# EAGLE design teensyMotors02_up (EAGLE 9.1.3)

## Sheet 1 of 2
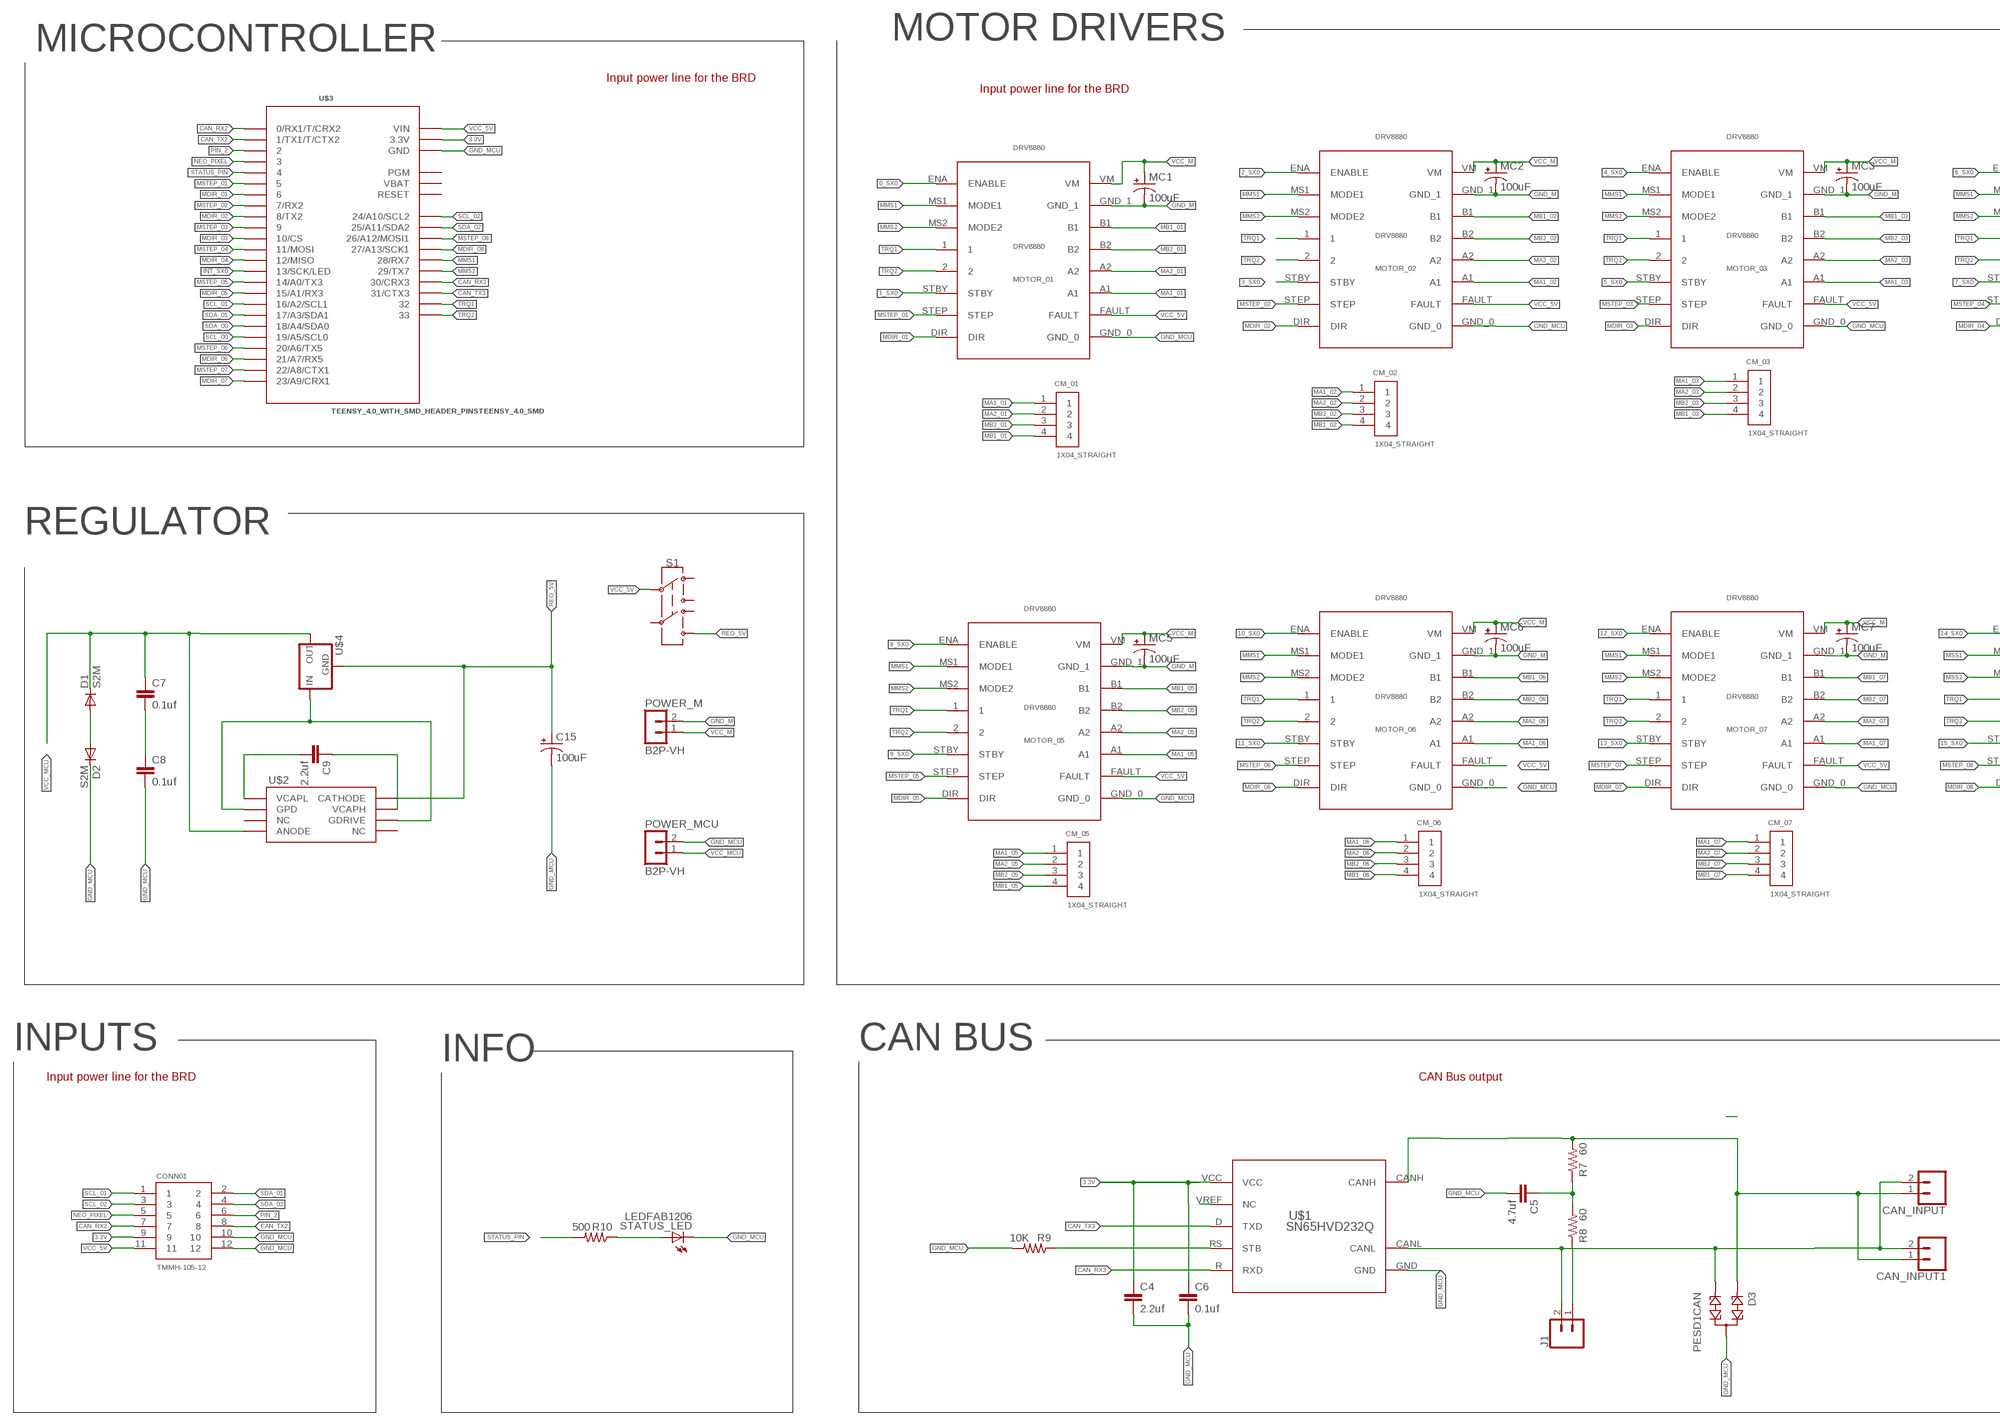
[diagram p0: schematic, sheet 1, part 1 of 2]
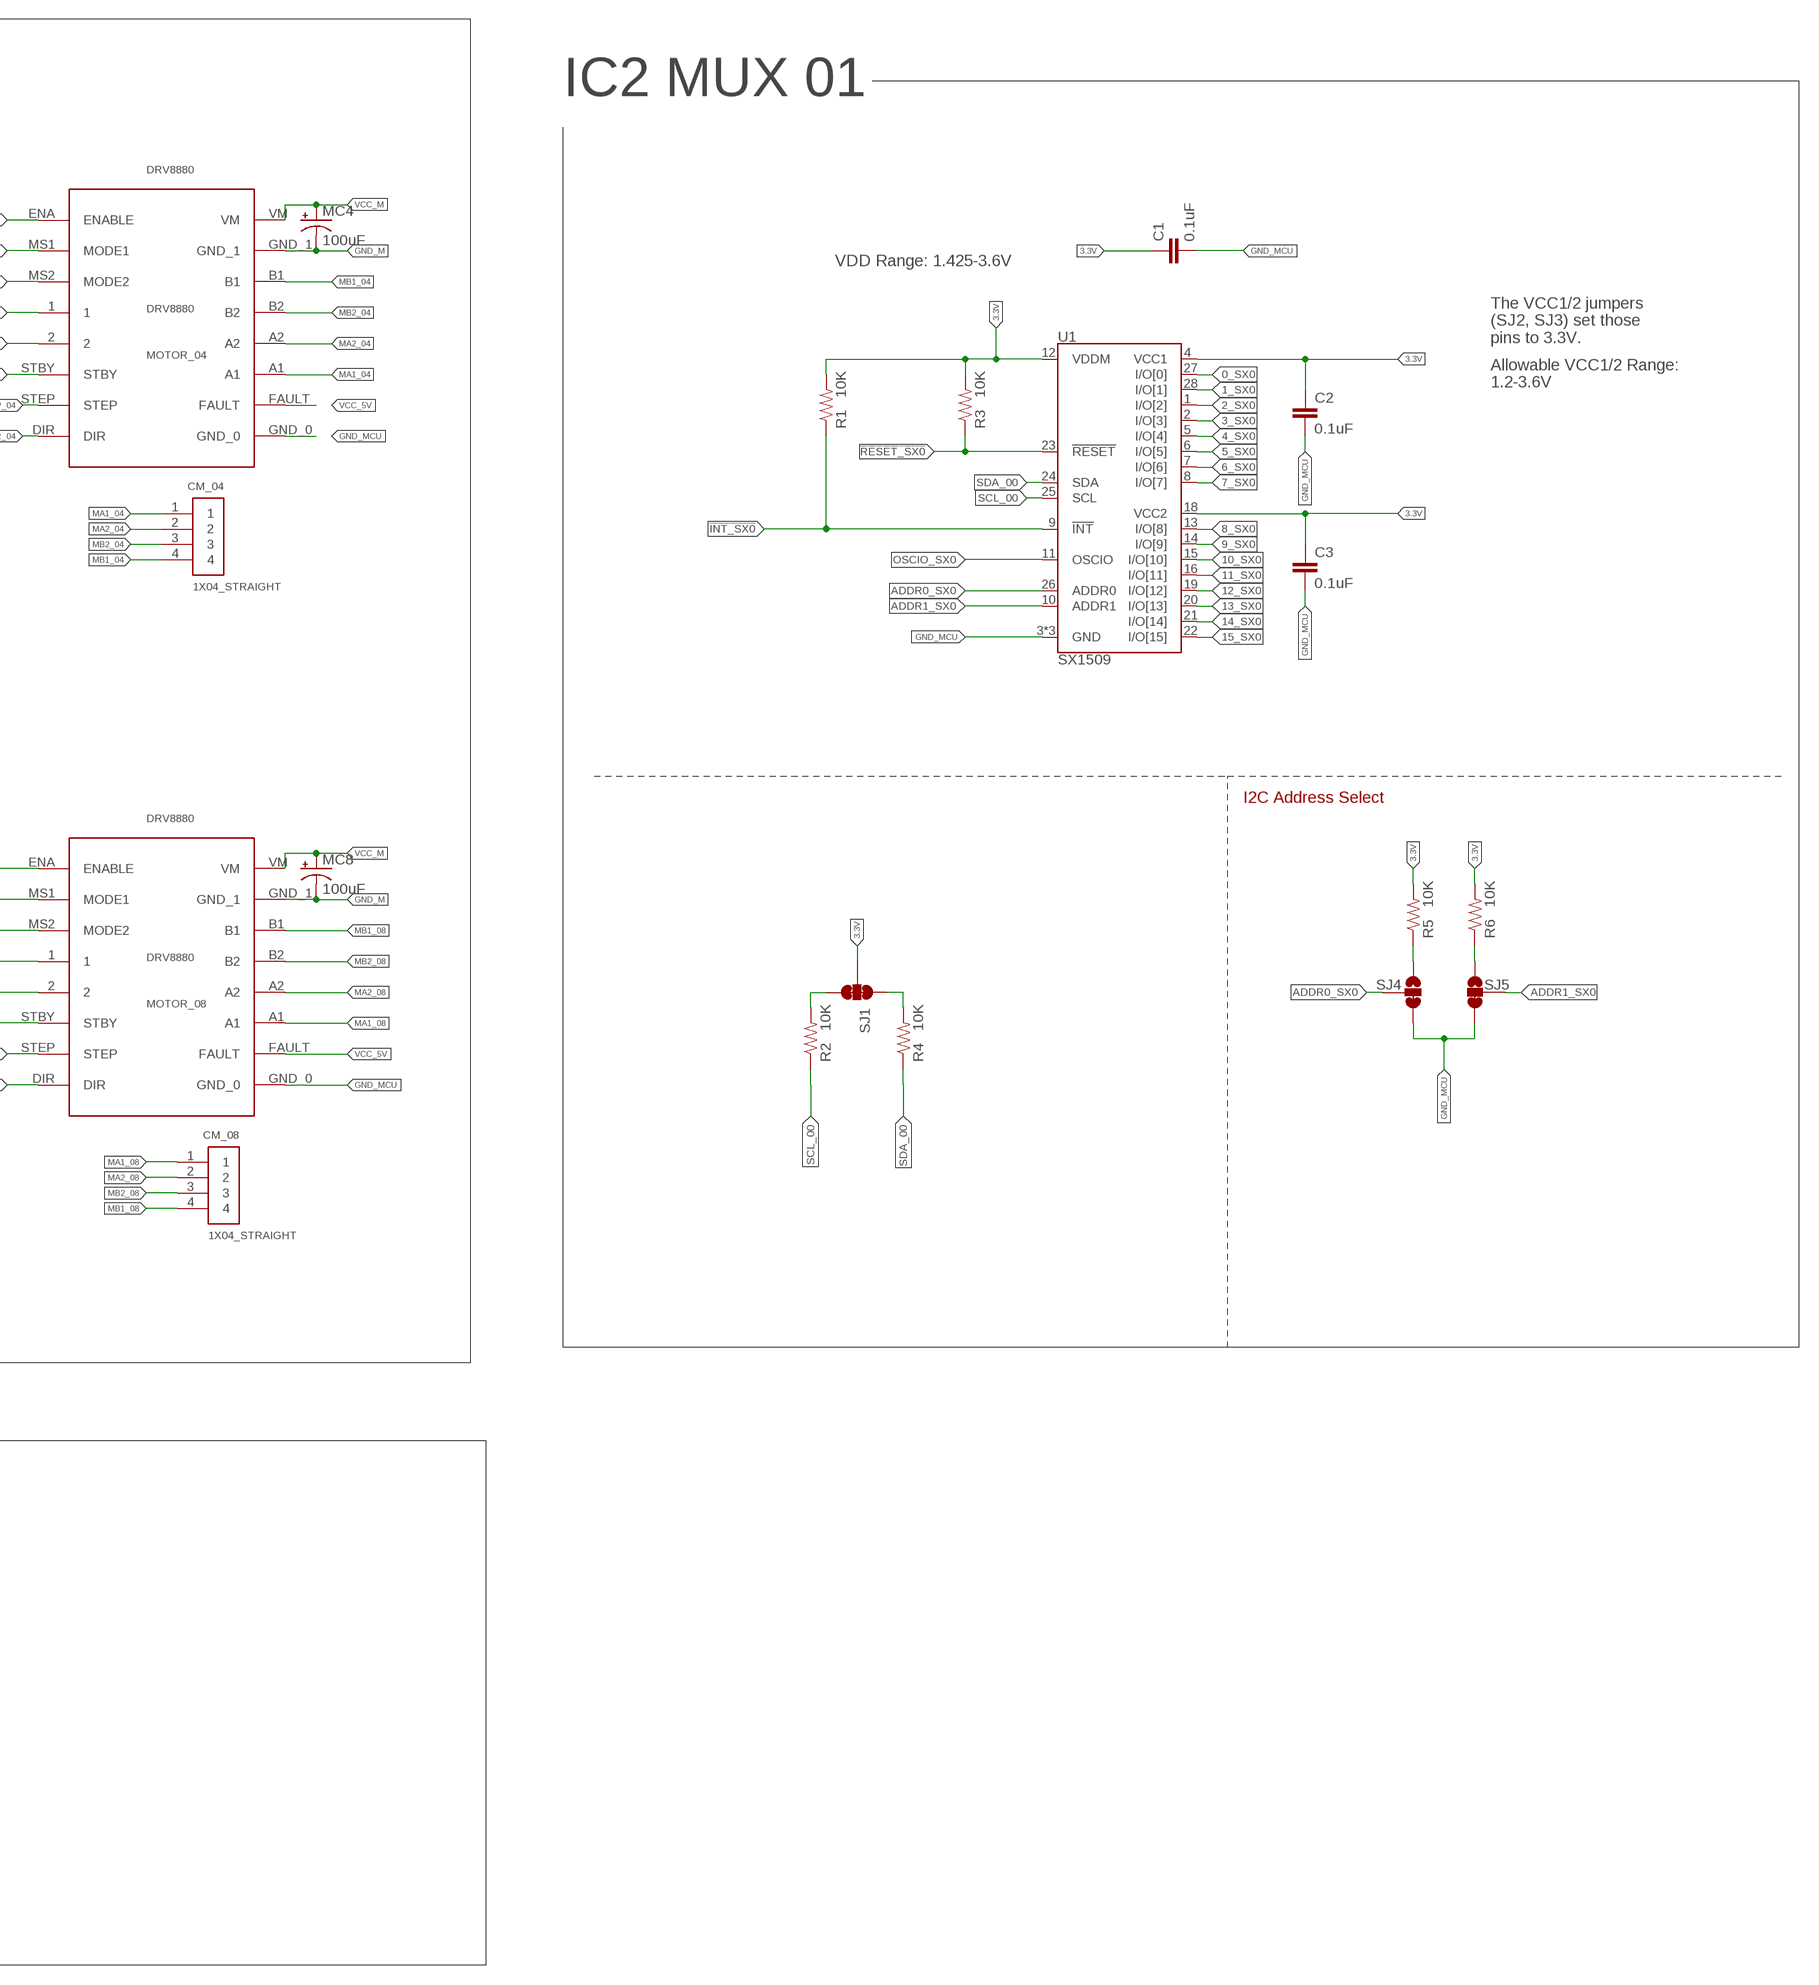
[diagram p1: schematic, sheet 1, part 2 of 2]

### Parts
C1  0.1uF  0.1UF-25V(+80/-20%)(0603)  [0603-CAP]
C2  0.1uF  0.1UF-25V(+80/-20%)(0603)  [0603-CAP]
C3  0.1uF  0.1UF-25V(+80/-20%)(0603)  [0603-CAP]
C4  2.2uf  0.1UF-25V(+80/-20%)(0603)  [0603-CAP]
C5  4.7uf  0.1UF-25V(+80/-20%)(0603)  [0603-CAP]
C6  0.1uf  0.1UF-25V(+80/-20%)(0603)  [0603-CAP]
C7  0.1uf  0.1UF-25V(+80/-20%)(0603)  [0603-CAP]
C8  0.1uf  0.1UF-25V(+80/-20%)(0603)  [0603-CAP]
C9  2.2uf  0.1UF-25V(+80/-20%)(0603)  [0603-CAP]
C15  100uF  100UF-POLAR-25V-20%(ELEC)  [PANASONIC_D]
CAN_INPUT  CONN_02-JST-2MM-SMT  [JST-2-SMD]
CAN_INPUT1  CONN_02-JST-2MM-SMT  [JST-2-SMD]
CM_01  1X04_STRAIGHT  1X4-CLEANBIG  [1X04-CLEANBIG]
CM_02  1X04_STRAIGHT  1X4-CLEANBIG  [1X04-CLEANBIG]
CM_03  1X04_STRAIGHT  1X4-CLEANBIG  [1X04-CLEANBIG]
CM_04  1X04_STRAIGHT  1X4-CLEANBIG  [1X04-CLEANBIG]
CM_05  1X04_STRAIGHT  1X4-CLEANBIG  [1X04-CLEANBIG]
CM_06  1X04_STRAIGHT  1X4-CLEANBIG  [1X04-CLEANBIG]
CM_07  1X04_STRAIGHT  1X4-CLEANBIG  [1X04-CLEANBIG]
CM_08  1X04_STRAIGHT  1X4-CLEANBIG  [1X04-CLEANBIG]
CONN01  TMMH-105-12  [TMMH-105-12]
D1  S2M  [DO214AA]
D2  S2M  [DO214AA]
D3  PESD1CAN  [SOT23]
J1  CONN_02  [1X02]
MC1  100uF  100UF-POLAR-25V-20%(ELEC)  [PANASONIC_D]
MC2  100uF  100UF-POLAR-25V-20%(ELEC)  [PANASONIC_D]
MC3  100uF  100UF-POLAR-25V-20%(ELEC)  [PANASONIC_D]
MC4  100uF  100UF-POLAR-25V-20%(ELEC)  [PANASONIC_D]
MC5  100uF  100UF-POLAR-25V-20%(ELEC)  [PANASONIC_D]
MC6  100uF  100UF-POLAR-25V-20%(ELEC)  [PANASONIC_D]
MC7  100uF  100UF-POLAR-25V-20%(ELEC)  [PANASONIC_D]
MC8  100uF  100UF-POLAR-25V-20%(ELEC)  [PANASONIC_D]
MOTOR_01  DRV8880  [DRV8880]
MOTOR_02  DRV8880  [DRV8880]
MOTOR_03  DRV8880  [DRV8880]
MOTOR_04  DRV8880  [DRV8880]
MOTOR_05  DRV8880  [DRV8880]
MOTOR_06  DRV8880  [DRV8880]
MOTOR_07  DRV8880  [DRV8880]
MOTOR_08  DRV8880  [DRV8880]
POWER_M  B2P-VH  [B2P-VH]
POWER_MCU  B2P-VH  [B2P-VH]
R1  10K  10KOHM-1/10W-1%(0603)0603  [0603-RES]
R2  10K  10KOHM-1/10W-1%(0603)0603  [0603-RES]
R3  10K  10KOHM-1/10W-1%(0603)0603  [0603-RES]
R4  10K  10KOHM-1/10W-1%(0603)0603  [0603-RES]
R5  10K  10KOHM-1/10W-1%(0603)0603  [0603-RES]
R6  10K  10KOHM-1/10W-1%(0603)0603  [0603-RES]
R7  60  10KOHM-1/10W-1%(0603)0603  [0603-RES]
R8  60  10KOHM-1/10W-1%(0603)0603  [0603-RES]
R9  10K  10KOHM-1/10W-1%(0603)0603  [0603-RES]
R10  500  10KOHM-1/10W-1%(0603)0603  [0603-RES]
S1  SWITCH-DPDT-SMD-AYZ0202  [SWITCH_DPDT_SMD_AYZ0202]
SJ1  JUMPER-PAD-3-NC_BY_TRACE  [PAD-JUMPER-3-3OF3_NC_BY_TRACE_YES_SILK_FULL_BOX]
SJ4  JUMPER-PAD-3-2OF3_NC_BY_TRACE_SMALL  [PAD-JUMPER-3-2OF3_NC_BY_TRACE_YES_SILK_FULL_BOX]
SJ5  JUMPER-PAD-3-2OF3_NC_BY_TRACE_SMALL  [PAD-JUMPER-3-2OF3_NC_BY_TRACE_YES_SILK_FULL_BOX]
STATUS_LED  LEDFAB1206  [LED1206FAB]
U1  SX1509  [QFN-28]
U$1  SN65HVD232Q  [SN65HVD232Q]
U$2  LM74610-Q1  [VSSOP(8)]
U$3  TEENSY_4.0_WITH_SMD_HEADER_PINSTEENSY_4.0_SMD  [TEENSY_4.0_SMD]
U$4  BUK  [TO263-3]

### Nets
0_SX0: MOTOR_01.ENA(ENABLE) U1.27(I/O[0])
1_SX0: MOTOR_01.STBY U1.28(I/O[1])
2_SX0: MOTOR_02.ENA(ENABLE) U1.1(I/O[2])
3.3V: C1.1 C2.1 C3.1 C4.1 C6.1 CONN01.9 R1.2 R3.2 R5.2 R6.2 SJ1.2 U1.4(VCC1) U1.12(VDDM) U1.18(VCC2) U$1.VCC U$3.3.3V U$3.3.3V1(3.3V)
3_SX0: MOTOR_02.STBY U1.2(I/O[3])
4_SX0: MOTOR_03.ENA(ENABLE) U1.5(I/O[4])
5_SX0: MOTOR_03.STBY U1.6(I/O[5])
6_SX0: MOTOR_04.ENA(ENABLE) U1.7(I/O[6])
7_SX0: MOTOR_04.STBY U1.8(I/O[7])
8_SX0: MOTOR_05.ENA(ENABLE) U1.13(I/O[8])
9_SX0: MOTOR_05.STBY U1.14(I/O[9])
10_SX0: MOTOR_06.ENA(ENABLE) U1.15(I/O[10])
11_SX0: MOTOR_06.STBY U1.16(I/O[11])
12_SX0: MOTOR_07.ENA(ENABLE) U1.19(I/O[12])
13_SX0: MOTOR_07.STBY U1.20(I/O[13])
14_SX0: MOTOR_08.ENA(ENABLE) U1.21(I/O[14])
15_SX0: MOTOR_08.STBY U1.22(I/O[15])
!INT_SX0: R1.1 U1.9(!INT) U$3.13(13/SCK/LED)
!RESET_SX0: R3.1 U1.23(!RESET)
ADDR0_SX0: SJ4.2 U1.26(ADDR0)
ADDR1_SX0: SJ5.2 U1.10(ADDR1)
CAN_H: CAN_INPUT1.1 CAN_INPUT.1 D3.1 R7.2 U$1.CANH
CAN_L: CAN_INPUT1.2 CAN_INPUT.2 D3.2 J1.2 U$1.CANL
CAN_RX2: CONN01.7 U$3.0(0/RX1/T/CRX2)
CAN_RX3: U$1.R(RXD) U$3.30(30/CRX3)
CAN_TX2: CONN01.8 U$3.1(1/TX1/T/CTX2)
CAN_TX3: U$1.D(TXD) U$3.31(31/CTX3)
GND_M: MC1.- MC2.- MC3.- MC4.- MC5.- MC6.- MC7.- MC8.- MOTOR_01.GND_1 MOTOR_02.GND_1 MOTOR_03.GND_1 MOTOR_04.GND_1 MOTOR_05.GND_1 MOTOR_06.GND_1 MOTOR_07.GND_1 MOTOR_08.GND_1 POWER_M.2
GND_MCU: C1.2 C2.2 C3.2 C4.2 C5.2 C6.2 C8.2 C15.- CONN01.10 CONN01.12 D2.C D3.3 MOTOR_01.GND_0 MOTOR_02.GND_0 MOTOR_03.GND_0 MOTOR_04.GND_0 MOTOR_05.GND_0 MOTOR_06.GND_0 MOTOR_07.GND_0 MOTOR_08.GND_0 POWER_MCU.2 R9.2 SJ4.3 SJ5.3 STATUS_LED.2(C) U1.3(GND) U1.17(GND) U1.29(GND) U$1.GND U$3.GND U$3.GND1(GND) U$3.GND2(GND)
MA1_01 [drv]: CM_01.1 MOTOR_01.A1
MA1_02 [drv]: CM_02.1 MOTOR_02.A1
MA1_03 [drv]: CM_03.1 MOTOR_03.A1
MA1_04 [drv]: CM_04.1 MOTOR_04.A1
MA1_05 [drv]: CM_05.1 MOTOR_05.A1
MA1_06 [drv]: CM_06.1 MOTOR_06.A1
MA1_07 [drv]: CM_07.1 MOTOR_07.A1
MA1_08 [drv]: CM_08.1 MOTOR_08.A1
MA2_01 [drv]: CM_01.2 MOTOR_01.A2
MA2_02 [drv]: CM_02.2 MOTOR_02.A2
MA2_03 [drv]: CM_03.2 MOTOR_03.A2
MA2_04 [drv]: CM_04.2 MOTOR_04.A2
MA2_05 [drv]: CM_05.2 MOTOR_05.A2
MA2_06 [drv]: CM_06.2 MOTOR_06.A2
MA2_07 [drv]: CM_07.2 MOTOR_07.A2
MA2_08 [drv]: CM_08.2 MOTOR_08.A2
MB1_01 [drv]: CM_01.4 MOTOR_01.B1
MB1_02 [drv]: CM_02.4 MOTOR_02.B1
MB1_03 [drv]: CM_03.4 MOTOR_03.B1
MB1_04 [drv]: CM_04.4 MOTOR_04.B1
MB1_05 [drv]: CM_05.4 MOTOR_05.B1
MB1_06 [drv]: CM_06.4 MOTOR_06.B1
MB1_07 [drv]: CM_07.4 MOTOR_07.B1
MB1_08 [drv]: CM_08.4 MOTOR_08.B1
MB2_01 [drv]: CM_01.3 MOTOR_01.B2
MB2_02 [drv]: CM_02.3 MOTOR_02.B2
MB2_03 [drv]: CM_03.3 MOTOR_03.B2
MB2_04 [drv]: CM_04.3 MOTOR_04.B2
MB2_05 [drv]: CM_05.3 MOTOR_05.B2
MB2_06 [drv]: CM_06.3 MOTOR_06.B2
MB2_07 [drv]: CM_07.3 MOTOR_07.B2
MB2_08 [drv]: CM_08.3 MOTOR_08.B2
MDIR_01: MOTOR_01.DIR U$3.6
MDIR_02: MOTOR_02.DIR U$3.8(8/TX2)
MDIR_03: MOTOR_03.DIR U$3.10(10/CS)
MDIR_04: MOTOR_04.DIR U$3.12(12/MISO)
MDIR_05: MOTOR_05.DIR U$3.15/A1(15/A1/RX3)
MDIR_06: MOTOR_06.DIR U$3.21/A7(21/A7/RX5)
MDIR_07: MOTOR_07.DIR U$3.23/A9(23/A9/CRX1)
MDIR_08: MOTOR_08.DIR U$3.27(27/A13/SCK1)
MMS1: MOTOR_01.MS1(MODE1) MOTOR_02.MS1(MODE1) MOTOR_03.MS1(MODE1) MOTOR_04.MS1(MODE1) MOTOR_05.MS1(MODE1) MOTOR_06.MS1(MODE1) MOTOR_07.MS1(MODE1) U$3.28(28/RX7)
MMS2: MOTOR_01.MS2(MODE2) MOTOR_02.MS2(MODE2) MOTOR_03.MS2(MODE2) MOTOR_04.MS2(MODE2) MOTOR_05.MS2(MODE2) MOTOR_06.MS2(MODE2) MOTOR_07.MS2(MODE2) U$3.29(29/TX7)
MSS1: MOTOR_08.MS1(MODE1)
MSS2: MOTOR_08.MS2(MODE2)
MSTEP_01: MOTOR_01.STEP U$3.5
MSTEP_02: MOTOR_02.STEP U$3.7(7/RX2)
MSTEP_03: MOTOR_03.STEP U$3.9
MSTEP_04: MOTOR_04.STEP U$3.11(11/MOSI)
MSTEP_05: MOTOR_05.STEP U$3.14/A0(14/A0/TX3)
MSTEP_06: MOTOR_06.STEP U$3.20/A6(20/A6/TX5)
MSTEP_07: MOTOR_07.STEP U$3.22/A8(22/A8/CTX1)
MSTEP_08: MOTOR_08.STEP U$3.26(26/A12/MOSI1)
N$1: R2.2 SJ1.3
N$2: C9.1 U$2.VCAPH
N$3: U$1.VREF(NC)
N$4: U$2.GDRIVE U$2.GPD U$4.1(IN)
N$5: C9.2 U$2.VCAPL
N$6: R9.1 U$1.RS(STB)
N$7: R4.2 SJ1.1
N$8: R5.1 SJ4.1
N$9: C7.2 C8.1
N$10: R6.1 SJ5.1
N$12: D1.A D2.A
N$13: C5.1 R7.1 R8.2
N$14: J1.1 R8.1
N$193: R10.1 STATUS_LED.1(A)
NEO_PIXEL: CONN01.5 U$3.3
OSCIO_SX0: U1.11(OSCIO)
PIN_2: CONN01.6 U$3.2
REG_5V: C15.+ S1.6 U$2.CATHODE U$4.4(GND)
SCL_00: R2.1 U1.25(SCL) U$3.19/A5(19/A5/SCL0)
SCL_01: CONN01.1 U$3.16/A2(16/A2/SCL1)
SCL_02: CONN01.3 U$3.24(24/A10/SCL2)
SDA_00: R4.1 U1.24(SDA) U$3.18/A4(18/A4/SDA0)
SDA_01: CONN01.2 U$3.17/A3(17/A3/SDA1)
SDA_02: CONN01.4 U$3.25(25/A11/SDA2)
STATUS_PIN: R10.2 U$3.4
TRQ1: MOTOR_01.1 MOTOR_02.1 MOTOR_03.1 MOTOR_04.1 MOTOR_05.1 MOTOR_06.1 MOTOR_07.1 MOTOR_08.1 U$3.32
TRQ2: MOTOR_01.2 MOTOR_02.2 MOTOR_03.2 MOTOR_04.2 MOTOR_05.2 MOTOR_06.2 MOTOR_07.2 MOTOR_08.2 U$3.33
VCC_5V [5v]: CONN01.11 MOTOR_01.FAULT MOTOR_02.FAULT MOTOR_03.FAULT MOTOR_04.FAULT MOTOR_05.FAULT MOTOR_06.FAULT MOTOR_07.FAULT MOTOR_08.FAULT S1.2 U$3.VIN
VCC_M [vcc]: MC1.+ MC2.+ MC3.+ MC4.+ MC5.+ MC6.+ MC7.+ MC8.+ MOTOR_01.VM MOTOR_02.VM MOTOR_03.VM MOTOR_04.VM MOTOR_05.VM MOTOR_06.VM MOTOR_07.VM MOTOR_08.VM POWER_M.1
VCC_MCU [vcc]: C7.1 D1.C POWER_MCU.1 U$2.ANODE U$4.3(OUT)
Unconnected: S1.1 S1.3 S1.4 S1.5 U$2.NC@1(NC) U$2.NC@2(NC) U$3.PGM U$3.RESET

### Notes on the sheet
- MICROCONTROLLER | MOTOR DRIVERS
- Input power line for the BRD
- Input power line for the BRD | IC2 MUX 01
- VDD Range: 1.425-3.6V
- The VCC1/2 jumpers 
  (SJ2, SJ3) set those 
  pins to 3.3V.
- Allowable VCC1/2 Range: 
  1.2-3.6V
- REGULATOR
- I2C Address Select
- INPUTS | INFO | CAN BUS
- Input power line for the BRD | CAN Bus output

## Sheet 2 of 2

## Power pins joined to a net without a drawn wire
VBAT: U$3.VBAT

## Library data of the parts
C1-C3 = SparkFun-Capacitors:0.1UF-25V(+80/-20%)(0603): CAP-00810 Ceramic Standard decoupling cap; PROD_ID: CAP-00810
C4-C9 = SparkFun-Capacitors:0.1UF-25V(+80/-20%)(0603): CAP-00810 Ceramic Standard decoupling cap; PROD_ID: CAP-00810; VALUE: 0.1uF
C15 MC1-MC8 = SparkFun-Capacitors:100UF-POLAR: 100µF polarized capacitors A capacitor is a passive two-terminal electrical component used to store electrical energy temporarily in an electric field.; PROD_ID: CAP-12547
CAN_INPUT CAN_INPUT1 = SparkFun-Connectors:CONN_02: Multi connection point. Often used as Generic Header-pin footprint for 0.1 inch spaced/style header connections On any of the 0.1 inch spaced packages, you can populate with these: Break Away Headers - Straight <https://www.sparkfun.com/products/116> (PRT-00116) Break Away Male Headers - Right Angle <https://www.sparkfun.com/products/553> (PRT-00553) Female Headers <https://www.sparkfun.com/products/115> (PRT-00115) Break Away Headers - Machine Pin <https://www.sparkfun.com/products/117> (PRT-00117) Break Away Female Headers - Swiss Machine Pin <https://www.sparkfun.com/products/743> (PRT-00743) For SCREWTERMINALS and SPRING TERMINALS visit here: Screw Terimnals on SparkFun.com <https://www.sparkfun.com/search/results?term=Screw+Terminals> (5mm/3.5mm/2.54mm spacing) This device is also useful as a general connection point to wire up your design to another part of your project. Our various solder wires solder well into these plated through hole pads. Hook-Up Wire - Assortment (Stranded, 22 AWG) <https://www.sparkfun.com/products/11375> (PRT-11375) Hook-Up Wire - Assortment (Solid Core, 22 AWG) <https://www.sparkfun.com/products/11367> (PRT-11367) View the entire wire category on our website here <https://www.sparkfun.com/categories/141> Special notes: Molex polarized connector foot print use with: PRT-08233 with associated crimp pins and housings. 2.54_SCREWTERM for use with PRT-10571. 3.5mm Screw Terminal footprints for PRT-08084 5mm Screw Terminal footprints for use with PRT-08432; PROD_ID: CONN-11443
CM_01-CM_08 = adafruit:1X4: 4-pin connector
CONN01 = TMMH-105-XX-XX-DV:TMMH-105-12: 2mm (.0787") Flex Shroud, .020" (.51mm) Square Post Terminal Strip, Surface Mount,10 Pins.
D1 D2 = s2x_10:S2*: S2A - S2M General Purpose Rectifiers Source: http://www.fairchildsemi.com/datasheets/S2/S2A.pdf; MF: Fairchild; MPN: S2M; OC_FARNELL: 9843876; OC_NEWARK: 58K9553
D3 = diode:PESD1CAN: CAN bus ESD protection diode Source: http://www.nxp.com/documents/data_sheet/PESD1CAN.pdf
J1 = SparkFun-Connectors:CONN_02: Multi connection point. Often used as Generic Header-pin footprint for 0.1 inch spaced/style header connections On any of the 0.1 inch spaced packages, you can populate with these: Break Away Headers - Straight <https://www.sparkfun.com/products/116> (PRT-00116) Break Away Male Headers - Right Angle <https://www.sparkfun.com/products/553> (PRT-00553) Female Headers <https://www.sparkfun.com/products/115> (PRT-00115) Break Away Headers - Machine Pin <https://www.sparkfun.com/products/117> (PRT-00117) Break Away Female Headers - Swiss Machine Pin <https://www.sparkfun.com/products/743> (PRT-00743) For SCREWTERMINALS and SPRING TERMINALS visit here: Screw Terimnals on SparkFun.com <https://www.sparkfun.com/search/results?term=Screw+Terminals> (5mm/3.5mm/2.54mm spacing) This device is also useful as a general connection point to wire up your design to another part of your project. Our various solder wires solder well into these plated through hole pads. Hook-Up Wire - Assortment (Stranded, 22 AWG) <https://www.sparkfun.com/products/11375> (PRT-11375) Hook-Up Wire - Assortment (Solid Core, 22 AWG) <https://www.sparkfun.com/products/11367> (PRT-11367) View the entire wire category on our website here <https://www.sparkfun.com/categories/141> Special notes: Molex polarized connector foot print use with: PRT-08233 with associated crimp pins and housings. 2.54_SCREWTERM for use with PRT-10571. 3.5mm Screw Terminal footprints for PRT-08084 5mm Screw Terminal footprints for use with PRT-08432
MOTOR_01-MOTOR_08 = STSPIN220:DRV8880
POWER_M POWER_MCU = con-JST VH:B2P-VH: JST VH Series header 3.96mm pitch disconnectable crimp style connectors, vertical (side entry type), 2 pins
R1-R6 R9 = SparkFun-Resistors:10KOHM-1/10W-1%(0603): RES-00824; PROD_ID: RES-00824
R7 R8 R10 = SparkFun-Resistors:10KOHM-1/10W-1%(0603): RES-00824; PROD_ID: RES-00824; VALUE: 10K
S1 = SparkFun-Switches:SWITCH-DPDT: Double-Pole, Double-Throw (DPDT) Switch Double-pole, double-throw switches. Variant Overview PTH-GPI-152-3013 Used on SparkFun Geiger Counter <https://www.sparkfun.com/products/11345> SMD-AY0202 Surface Mount DPDT Switch <https://www.sparkfun.com/products/597> (COM-00597) Used on e.g. LilyPad Arduino USB - ATmega32U4 Board <https://www.sparkfun.com/products/12049>; PROD_ID: SWCH-08179; SF_SKU: COM-00597; SPICEPREFIX: X
SJ1 = SparkFun-Passives:JUMPER-PAD-3-NC_BY_TRACE
SJ4 SJ5 = SparkFun-Passives:JUMPER-PAD-3-2OF3_NC_BY_TRACE
STATUS_LED = fab:LED: LED
U1 = SparkFun-DigitalIC:SX1509: Semtech SX1509 The SX1509 is a complete ultra low voltage 1.2V to 3.6V General Purpose parallel Input/Output (GPIO) expanders ideal for low power handheld battery powered equipment. This version comes in a 16-channel configuration and allows easy serial expansion of I/O through a standard 400kHz I2C interface. GPIO devices can provide additional control and monitoring when the microcontroller or chipset has insufficient I/O ports, or in systems where serial communication and control from a remote location is advantageous.; PROD_ID: IC-11311
U$1 = TCAN1042DRQ1:SN65HVD232Q
U$2 = 1zac:LM74610-Q1: LM74610-Q1 Zero IQ Reverse Polarity Protection Smart Diode Controller; MPN: LM74610-Q1
U$3 = Teensy4:TEENSY_4.0_WITH_SMD_HEADER_PINS: Footprint for Teensy 3.1 or 3.2 board using all pin connections on the outer perimeter
U$4 = v-reg-2:BUK

## Net classes
0 default: width 0.2 mm
1 2oz: width 0.2 mm
2 drv: width 0.55 mm
3 vcc: width 0.4 mm
4 5v: width 0.3 mm

## Board
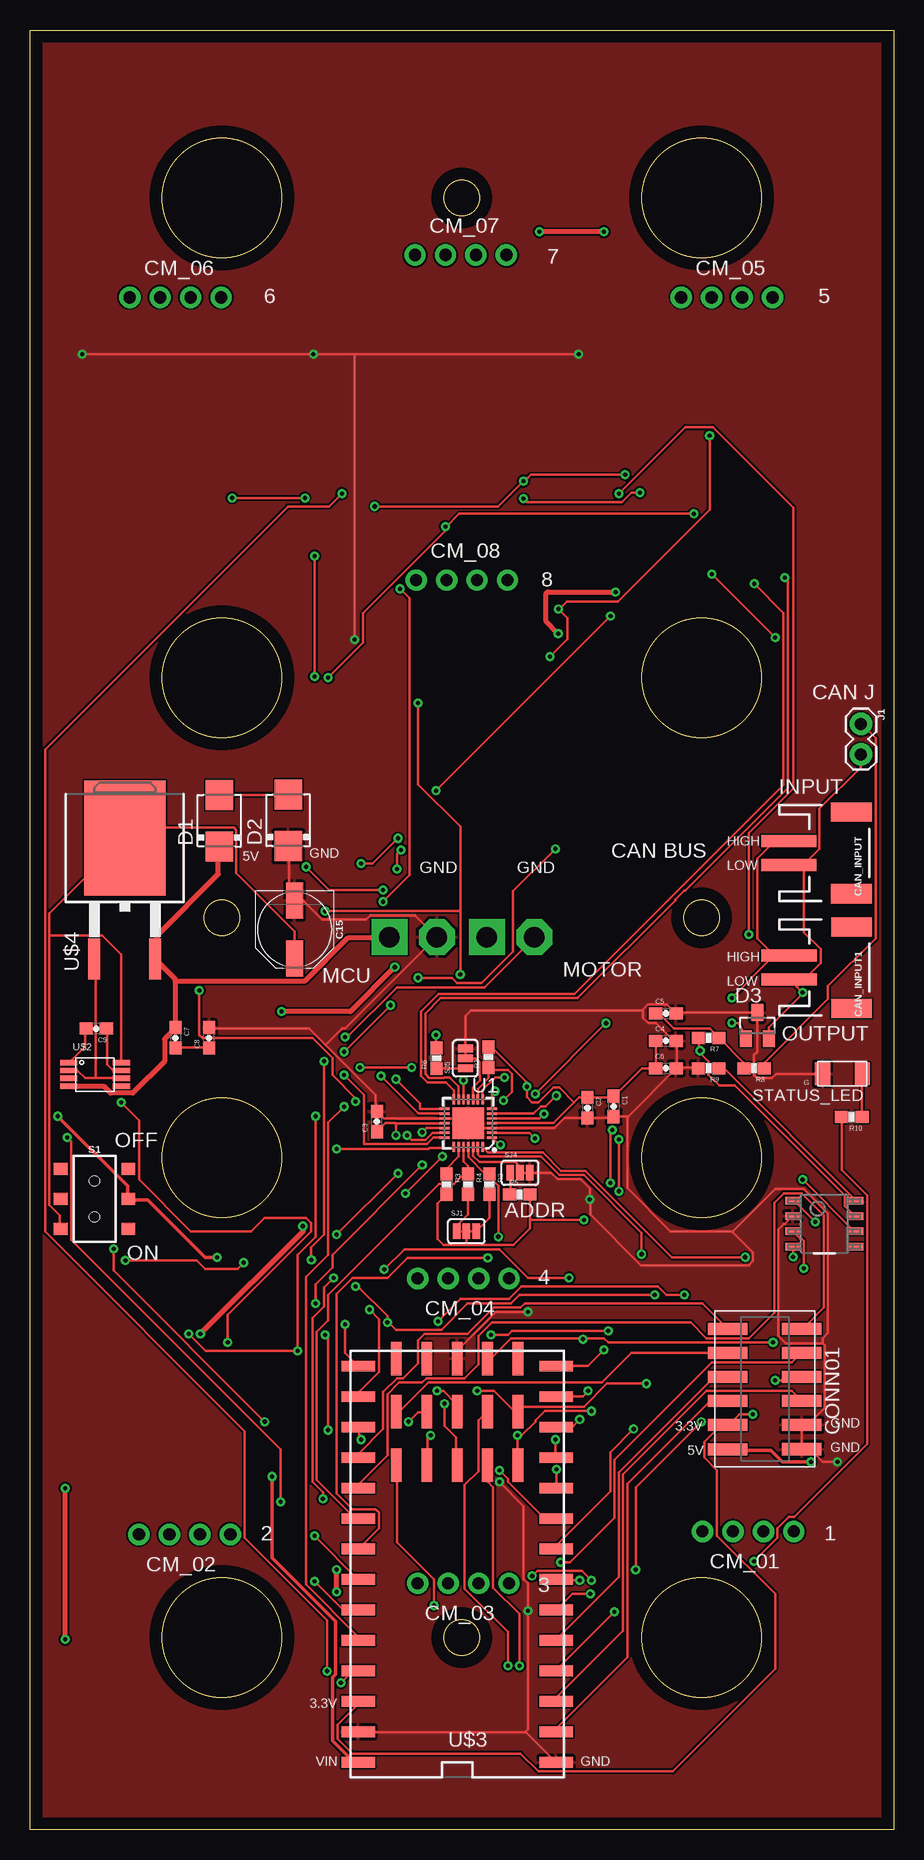
[diagram p2: board, top side]
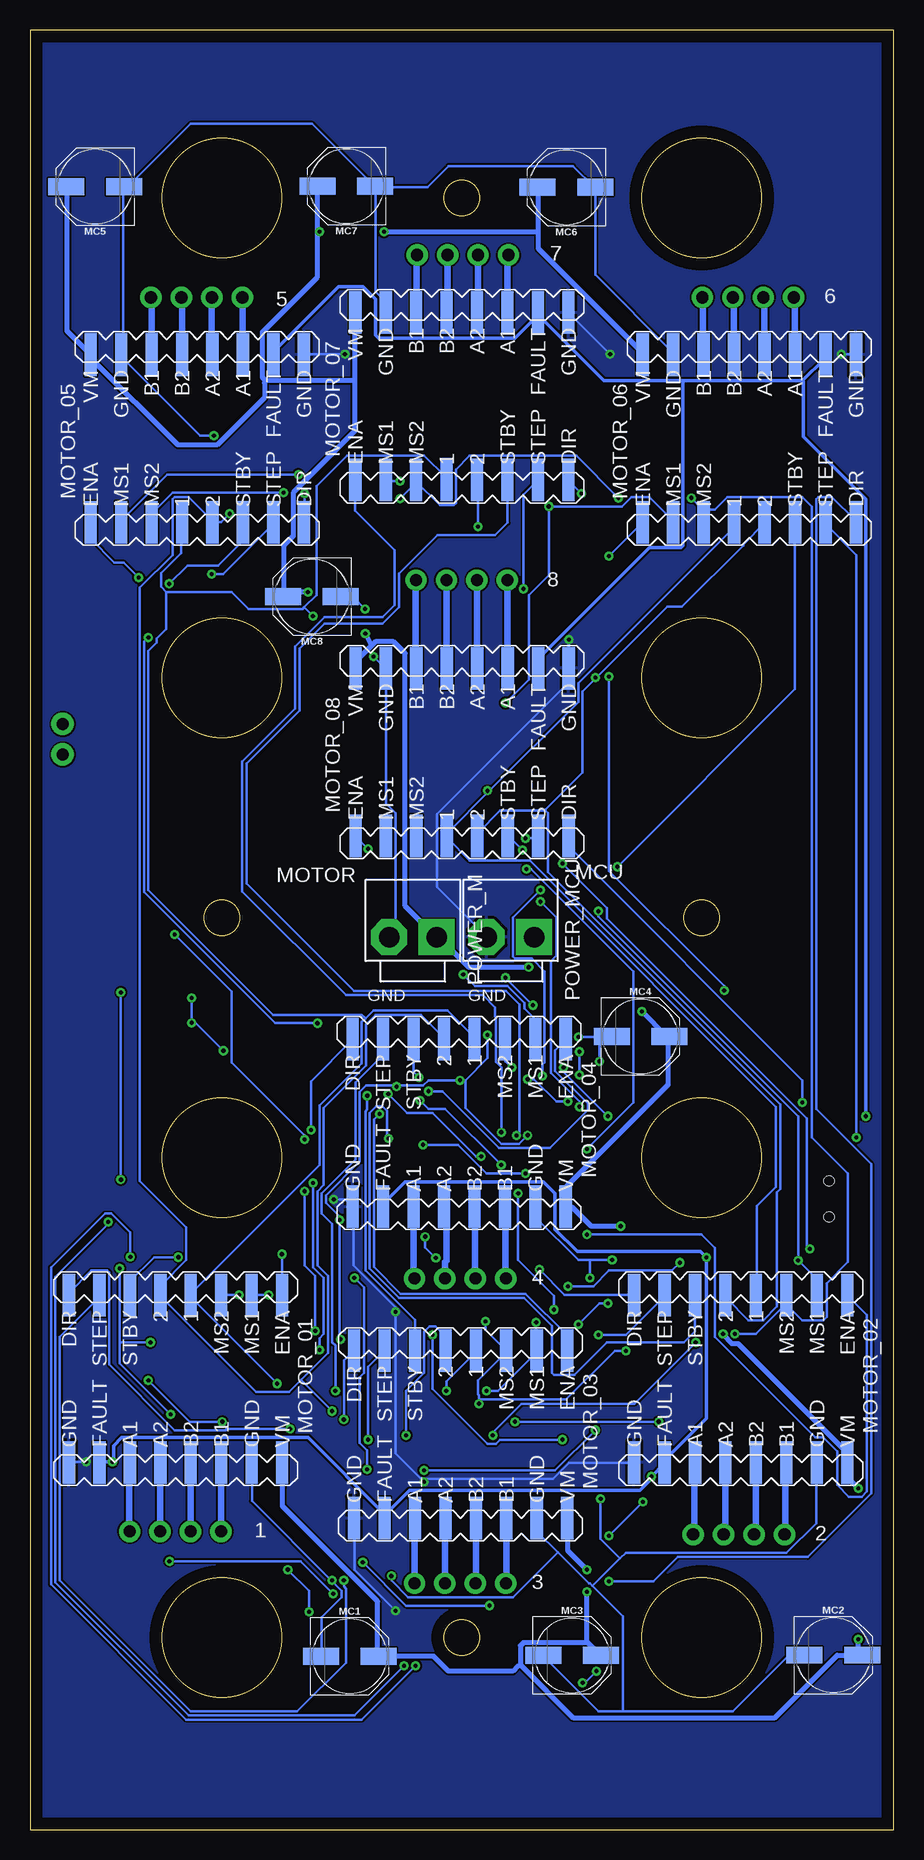
[diagram p3: board, bottom side, seen from below]

Size 72 x 150 mm. Coordinates in mm from the lower left corner, seen from the top.
Outline: 72,150 72,0 0,0 0,150 72,150
Outline: circle at 56,136 radius 5
Outline: circle at 56,96 radius 5
Outline: circle at 56,56 radius 5
Outline: circle at 56,16 radius 5
Outline: circle at 16,16 radius 5
Outline: circle at 16,56 radius 5
Outline: circle at 16,96 radius 5
Outline: circle at 16,136 radius 5
Outline: circle at 36,136 radius 1.5
Outline: circle at 16,76 radius 1.5
Outline: circle at 36,16 radius 1.5
Outline: circle at 56,76 radius 1.5
Copper layers (1*2*15*16): Top 0.035mm / dielectric 10mil / Route2 0.035mm / dielectric 40mil / Route15 0.035mm / dielectric 10mil / Bottom 0.035mm
Design rules "default *": minimum track width 6mil, minimum drill 0.35mm, track to track 6mil, track to pad 6mil, pad to pad 6mil, via to via 6mil, smd to smd 6mil, copper to edge 40mil, drill to drill 6mil, minimum pad ring 10mil, minimum via ring 8mil, stop-mask expansion 4mil, vias tented up to drill 0mil, thermal gap 10mil

### Footprints (pad centres in the part's own frame; a part is rotated, then mirrored left to right if it is on the bottom)
0603-CAP = smd 1.1 x 1: 1 -0.85,0; 2 0.85,0
PANASONIC_D = smd 3 x 1.4: + 2.4,0; - -2.4,0
JST-2-SMD = smd 1 x 4.6: 1 -1,-3.7; 2 1,-3.7 | smd 1.6 x 3.4: NC1 -3.4,1.5; NC2 3.4,1.5
1X04-CLEANBIG = drill 1.016 pad 1.778: 1 -3.81,0; 2 -1.27,0; 3 1.27,0; 4 3.81,0
TMMH-105-12 = smd 1.016 x 3.302: 1 -5.27,-3.086; 2 -5.27,3.086; 3 -3.27,-3.086; 4 -3.27,3.086; 5 -1.27,-3.086; 6 -1.27,3.086; 7 0.73,-3.086; 8 0.73,3.086; 9 2.73,-3.086; 10 2.73,3.086; 11 4.781,-3.099; 12 4.755,3.086
DO214AA = smd 2.5 x 2.3: A 2.15,0; C -2.15,0
SOT23 = smd 1 x 1.4: 1 -0.95,-1.1; 2 0.95,-1.1; 3 0,1.1
1X02 = drill 1.016 pad 1.88: 1 0,0; 2 2.54,0
DRV8880 = smd 3.556 x 1.016: 1 -6.985,1.27; 2 -6.985,-1.27; A1 6.985,-3.81; A2 6.985,-1.27; B1 6.985,3.81; B2 6.985,1.27; DIR -6.985,-8.89; ENA -6.985,8.89; FAULT 6.985,-6.35; GND_0 6.985,-8.89; GND_1 6.985,6.35; MS1 -6.985,6.35; MS2 -6.985,3.81; STBY -6.985,-3.81; STEP -6.985,-6.35; VM 6.985,8.89
B2P-VH = drill 1.7 pad 3 square: 1 -1.98,0 | drill 1.7 pad 3 octagon: 2 1.98,0
0603-RES = smd 1.1 x 1: 1 -0.85,0; 2 0.85,0
SWITCH_DPDT_SMD_AYZ0202 = smd 1 x 1.15: 1 -2.5,2.825; 2 0,2.825; 3 2.5,2.825; 4 -2.5,-2.825; 5 0,-2.825; 6 2.5,-2.825 | hole 0.85: 1.5,0; -1.5,0
PAD-JUMPER-3-3OF3_NC_BY_TRACE_YES_SILK_FULL_BOX = smd 0.635 x 1.27: 1 -0.813,0; 2 0,0; 3 0.813,0
PAD-JUMPER-3-2OF3_NC_BY_TRACE_YES_SILK_FULL_BOX = smd 0.635 x 1.27: 1 -0.813,0; 2 0,0; 3 0.813,0
LED1206FAB = smd 1.27 x 1.905: 1 -1.651,0; 2 1.651,0
QFN-28 = smd 0.85 x 0.2: 1 -1.975,1.2; 2 -1.975,0.8; 3 -1.975,0.4; 4 -1.975,0; 5 -1.975,-0.4; 6 -1.975,-0.8; 7 -1.975,-1.2; 15 1.975,-1.2; 16 1.975,-0.8; 17 1.975,-0.4; 18 1.975,0; 19 1.975,0.4; 20 1.975,0.8; 21 1.975,1.2 | smd 0.2 x 0.85: 8 -1.2,-1.975; 9 -0.8,-1.975; 10 -0.4,-1.975; 11 0,-1.975; 12 0.4,-1.975; 13 0.8,-1.975; 14 1.2,-1.975; 22 1.2,1.975; 23 0.8,1.975; 24 0.4,1.975; 25 0,1.975; 26 -0.4,1.975; 27 -0.8,1.975; 28 -1.2,1.975 | smd 2.65 x 2.65: 29 0,0
SN65HVD232Q = smd 1.27 x 0.635: CANH 2.625,0.635; CANL 2.625,-0.635; D -2.625,1.905; GND -2.625,0.635; R -2.625,-1.905; RS 2.625,1.905; VCC -2.625,-0.635; VREF 2.625,-1.905
VSSOP(8) = smd 1.435 x 0.445: ANODE -2.2,-1.05; CATHODE 2.2,0.9; GDRIVE 2.2,-0.4; GPD -2.2,0.25; NC@1 -2.2,-0.4; NC@2 2.2,-1.05; VCAPH 2.2,0.25; VCAPL -2.2,0.9
TEENSY_4.0_SMD = smd 2.794 x 0.889: 0 -8.255,13.97; 1 -8.255,11.43; 2 -8.255,8.89; 3 -8.255,6.35; 3.3V 8.255,11.43; 4 -8.255,3.81; 5 -8.255,1.27; 6 -8.255,-1.27; 7 -8.255,-3.81; 8 -8.255,-6.35; 9 -8.255,-8.89; 10 -8.255,-11.43; 11 -8.255,-13.97; 12 -8.255,-16.51; 13 8.255,-16.51; 14/A0 8.255,-13.97; 15/A1 8.255,-11.43; 16/A2 8.255,-8.89; 17/A3 8.255,-6.35; 18/A4 8.255,-3.81; 19/A5 8.255,-1.27; 20/A6 8.255,1.27; 21/A7 8.255,3.81; 22/A8 8.255,6.35; 23/A9 8.255,8.89; GND -8.255,16.51; GND2 8.255,13.97; VIN 8.255,16.51 | smd 0.889 x 2.794: 3.3V1 -2.54,-17.145; 24 5.08,-12.7; 25 5.08,-8.255; 26 2.54,-12.7; 27 2.54,-8.255; 28 0,-12.7; 29 0,-8.255; 30 -2.54,-12.7; 31 -2.54,-8.255; 32 -5.08,-12.7; 33 -5.08,-8.255; GND1 0,-17.145; PGM 2.54,-17.145; RESET 5.08,-17.145; VBAT -5.08,-17.145
TO263-3 = smd 1 x 3.4: 1 -2.54,-9.14; 3 2.54,-9.14 | smd 6.8 x 9.6: 4 0,0.96

### Placement (x,y rotation side)
C1  48.66,60.27 270 top
C2  46.48,60.16 270 top
C3  28.93,59.01 90 top
C4  53.02,65.74 0 top
C5  53.02,68.03 0 top
C6  53.02,63.45 0 top
C7  12.13,65.99 270 top
C8  14.92,65.99 90 top
C9  5.53,66.76 180 top
C15  22.07,75.02 270 top
CAN_INPUT  66.97,81.4 270 top
CAN_INPUT1  66.99,71.84 270 top
CM_01  59.88,24.85 180 top
CM_02  12.89,24.59 180 top
CM_03  36.13,20.53 180 top
CM_04  36.13,45.93 180 top
CM_05  58.1,127.72 0 top
CM_06  12.13,127.72 0 top
CM_07  35.91,131.24 0 top
CM_08  36.01,104.15 0 top
CONN01  61.25,36.46 270 top
D1  15.78,84.09 90 top
D2  21.54,84.11 90 top
D3  60.64,67.01 0 top
J1  69.28,92.16 270 top
MC1  45.34,14.45 0 bottom
MC2  5.02,14.54 0 bottom
MC3  26.8,14.51 0 bottom
MC4  21.1,66.1 0 bottom
MC5  66.56,136.94 180 bottom
MC6  27.27,136.89 180 bottom
MC7  45.61,136.98 180 bottom
MC8  48.48,102.77 180 bottom
MOTOR_01  59.86,37.57 270 bottom
MOTOR_02  12.74,37.57 270 bottom
MOTOR_03  36.09,32.94 270 bottom
MOTOR_04  36.22,58.89 270 bottom
MOTOR_05  58.05,115.95 90 bottom
MOTOR_06  12.02,115.95 90 bottom
MOTOR_07  35.99,119.47 90 bottom
MOTOR_08  35.98,89.82 90 bottom
POWER_M  40.07,74.38 180 bottom
POWER_MCU  31.94,74.38 180 bottom
R1  38.23,64.36 90 top
R2  38.29,53.8 270 top
R3  34.74,53.8 270 top
R4  36.51,53.8 270 top
R5  40.85,52.93 0 top
R6  33.89,64.29 90 top
R7  56.58,65.99 180 top
R8  60.39,63.45 180 top
R9  56.58,63.45 180 top
R10  68.52,59.39 180 top
S1  5.39,52.56 270 top
SJ1  36.38,49.87 0 top
SJ4  40.86,54.74 0 top
SJ5  36.3,64.29 90 top
STATUS_LED  67.73,63 180 top
U1  36.55,58.87 180 top
U$1  66.23,50.5 0 top
U$2  5.43,63.02 0 top
U$3  35.61,22.12 180 top
U$4  7.91,81.69 0 top

### Tracks (layer width: path | path; a pad name or v marks a point on that pad's centre or on a via)
0_SX0  (via drill 0.35)
  Top 0.2: U1.27 37.35,56.27 37.53,56.09 42.61,56.09 44.13,54.56 46.17,54.56 50.99,49.74 v50.99,47.96
  Bottom 0.2: v50.99,47.96 50.99,44.57 MOTOR_01.ENA
1_SX0  (via drill 0.35)
  Top 0.2: U1.28 38.2,56.44 42.76,56.44 44.28,54.92 46.32,54.92 53.53,47.71 v59.63,47.71
  Bottom 0.2: v59.63,47.71 61.66,47.71 63.67,45.69 MOTOR_01.STBY
2_SX0  (via drill 0.35)
  Top 0.2: v39.23,57.08 39.14,57.08 38.61,57.61 U1.1 | v25.57,49.59 v30.68,54.7
  Bottom 0.2: v39.23,57.08 36.32,57.08 33.94,54.7 v30.68,54.7 | v25.57,49.59 16.03,49.59 14.91,48.47 14.91,41.04 6.54,32.67 5.84,32.67 4.69,31.53 4.69,28.71 3.72,27.74 2.66,27.74 2.22,28.18 2.22,42.89 3.81,44.48 MOTOR_02.ENA
3.3V  (via drill 0.35)
  Top 0.2: U1.4 38.54,58.88 43.63,58.88 45.37,60.62 | 45.37,60.62 45.76,61.01 C2.1 48.56,61.01 C1.1 48.74,61.13 51.03,63.42 52.09,63.42 C6.1 52.18,63.51 52.18,65.71 C4.1 | U1.18 30.43,58.87 30.42,58.88 | 30.42,58.88 29.65,58.88 C3.1 | SJ1.2 36.38,48.84 36.26,48.72 | 36.26,48.72 34.48,48.72 33.97,49.23 33.97,52.19 R3.2 | R5.2 41.7,50.82 | 41.7,50.82 41.7,50.09 40.32,48.72 36.26,48.72 | 45.37,60.62 44.16,61.84 43.63,61.84 42.4,60.6 41.87,60.6 41.43,61.04 v41.43,61.92 41.43,62.28 38.52,65.18 38.26,65.18 R1.2 | v36.14,62.45 36.14,60.87 U1.12 | v33.85,66.24 33.85,65.18 R6.2 | v30.5,57.87 30.5,58.84 30.42,58.88 | v46.19,50.82 41.7,50.82 | v64.51,46.77 64.51,49.06 64.33,49.24 64.25,49.24 63.63,49.85 U$1.VCC | v60.28,34.61 59.14,34.61 58.26,33.73 CONN01.9 58.08,33.73 57.64,33.73 56.23,32.32 56.23,31 57.29,29.94 57.29,24.48 62.13,19.64 62.13,13.38 53.59,4.83 42.4,4.83 40.9,6.33 26.89,6.33 25.66,7.57 25.66,8.71 27.33,10.38 27.33,10.65 U$3.3.3V | 46.1,40.96 47.86,40.96 48.21,40.6 v61.96,40.6 | 46.1,40.96 40.11,40.96 38.43,39.28 38.17,39.28 U$3.3.3V1 | v46.1,40.87 46.1,40.96
  Bottom 0.2: 35.7,62.45 v36.14,62.45 38.77,62.45 39.21,62.01 41.43,62.01 | 35.7,62.45 33.85,64.3 v33.85,66.24 | v30.5,57.87 31.21,57.17 32.71,57.17 35.7,60.16 35.7,62.45 | 41.43,62.01 43.98,62.01 44.51,61.48 44.51,55.67 47.33,52.85 47.33,52.23 46.19,51.09 v46.19,50.82 46.19,40.96 v46.1,40.87 | v41.43,61.92 41.43,62.01 | 64.51,40.6 64.51,38.84 v60.28,34.61 | 64.51,40.6 v64.51,46.77 | 64.51,40.6 v61.96,40.6
3_SX0  (via drill 0.35)
  Top 0.2: U1.2 41.64,58.07 v42.1,57.61
  Bottom 0.2: v42.1,57.61 42.23,57.74 42.23,59.9 42.6,60.27 43.13,60.27 43.68,59.72 43.68,46.75 41.23,44.31 30.82,44.31 28.47,41.96 28.47,38.04 28.33,37.9 26.59,37.9 23.9,40.59 17.46,40.59 16.55,41.51 MOTOR_02.STBY
4_SX0  (via drill 0.35)
  Top 0.2: U1.5 42.49,59.27 v42.86,59.64
  Bottom 0.2: MOTOR_03.ENA 27.2,41.19 30.67,44.66 41.09,44.66 43.33,46.9 43.33,59.18 v42.86,59.64
5_SX0  (via drill 0.35)
  Top 0.2: v43.88,61.17 42.99,60.27 42.6,60.27 42,59.67 U1.6
  Bottom 0.2: v43.88,61.17 43.88,60.02 44.03,59.87 44.03,46.61 39.9,42.48 MOTOR_03.STBY
6_SX0  (via drill 0.35)
  Top 0.2: 38.52,60.16 U1.7 38.52,61.29 v38.77,61.54
  Bottom 0.2: v38.77,61.54 37.61,61.54 32.88,56.81 28.65,56.81 25.48,59.99 25.48,60.51 28.21,63.24 28.21,64.92 27.33,65.8 MOTOR_04.ENA
7_SX0  (via drill 0.35)
  Top 0.2: U1.8 37.75,61.64 38.8,62.69 v39.56,62.69
  Bottom 0.2: v39.56,62.69 40.07,63.2 40.03,63.24 MOTOR_04.STBY
8_SX0  (via drill 0.35)
  Top 0.2: U1.13 35.75,61.93 34.99,62.69 34.55,62.69 34.49,62.64 33.28,62.64 32.96,62.97 32.96,68.03 34.23,69.3 45.66,69.3 53.81,77.44 53.81,77.53 54.55,78.27 54.63,78.27 63.18,86.82 63.18,104.09 v62.93,104.35
  Bottom 0.2: v62.93,104.35 64.2,105.62 64.96,105.62 66.94,107.6 MOTOR_05.ENA
9_SX0  (via drill 0.35)
  Top 0.2: v60.39,103.84 62.83,101.4 62.83,87.08 45.4,69.65 34.08,69.65 32.61,68.17 32.61,62.82 33.14,62.29 34.67,62.29 35.35,61.61 U1.14
  Bottom 0.2: v60.39,103.84 58.87,105.36 56.33,105.36 54.24,107.45 MOTOR_05.STBY
10_SX0  (via drill 0.35)
  Top 0.2: U1.15 32.53,60.07 32.53,60.16 32.53,60.51 v30.5,62.54 | v27.16,60.69 27.16,60.95 25.22,62.89 25.22,64.3 23.54,65.98 14.38,65.98 14.12,66.24 v14.12,69.94 | v23.72,106.15 v23.72,96.11
  Bottom 0.2: v30.5,62.54 29.97,62.54 28.12,60.69 v27.16,60.69 | v14.12,69.94 14.12,70.29 23.72,79.9 v23.72,96.11 | v23.72,106.15 20.99,108.88 MOTOR_06.ENA
11_SX0  (via drill 0.35)
  Top 0.2: U1.16 32.42,59.67 32.35,59.72 v29.27,62.8 | v29.45,78.31 24.95,78.31 v23.01,80.25
  Bottom 0.2: v29.27,62.8 29.27,63.77 29.09,63.95 29.09,71.53 30.15,72.58 31.56,72.58 31.74,72.76 31.74,76.02 v29.45,78.31 | v23.01,80.25 8.21,95.05 8.21,108.88 MOTOR_06.STBY
12_SX0  (via drill 0.35)
  Top 0.2: U1.19 33.05,58.47 v32.7,58.12
  Bottom 0.2: v32.7,58.12 32.7,63.53 33.17,63.99 33.17,67.73 33.21,67.77 33.21,68.53 34.23,69.55 45.66,69.55 54.29,78.19 54.29,89.02 49.88,93.43 49.88,98.6 47.44,101.05 42.61,101.05 41.59,102.06 41.59,106.63 44.88,109.92 MOTOR_07.ENA
13_SX0  (via drill 0.35)
  Top 0.2: U1.20 33.55,58.07 32.97,57.49 31.81,57.49 v31.43,57.87
  Bottom 0.2: v31.43,57.87 31.18,58.12 31.18,68.79 32.29,69.9 44.99,69.9 53.94,78.85 53.94,88.87 49.53,93.29 49.53,98.45 47.44,100.54 42.62,100.54 41.24,101.92 41.24,104.7 38.04,107.9 33.21,107.9 32.18,108.94 MOTOR_07.STBY
14_SX0  (via drill 0.35)
  Top 0.2: U1.21 33.64,57.67 33.11,57.14 27.91,57.14 27.86,57.17 27.86,61.22 v26.19,62.89 | v30.06,68.71 v26.19,64.83 | v32.35,71 35.17,71 35.61,70.56 37.64,70.56 40.28,73.2 40.28,78.22 v43.81,81.75
  Bottom 0.2: v26.19,64.83 v26.19,62.89 | v32.35,71 v30.06,68.71 | v43.81,81.75 44.86,82.8 MOTOR_08.ENA
15_SX0  (via drill 0.35)
  Top 0.2: v25.57,56.73 33.23,56.73 33.32,56.81 35.35,56.81 U1.22 | v30.59,80.07 30.59,81.31 v30.94,81.66
  Bottom 0.2: v25.57,56.73 21.69,60.6 21.69,71.53 30.24,80.07 v30.59,80.07 | v30.94,81.66 32.09,82.8 MOTOR_08.STBY
!INT_SX0  (via drill 0.35)
  Top 0.2: U1.9 37.35,61.75 38.23,62.63 R1.1 38.26,63.33 39.84,63.33 40.19,62.98 40.19,61.48 v39.49,60.78 | v32.71,55.4 25.22,47.92 25.22,46.86 23.81,45.45 v23.81,43.86 | v26.27,42.1 26.27,39.72 27.33,38.66 U$3.13
  Bottom 0.2: v39.49,60.78 38.78,60.07 37.38,60.07 v32.71,55.4 | v23.81,43.86 24.51,43.86 v26.27,42.1
!RESET_SX0
  Top 0.2: U1.23 35.75,56.08 34.74,55.07 R3.1
ADDR0_SX0
  Top 0.2: U1.26 36.95,56.15 37.47,55.63 40.46,55.63 40.77,55.33 40.83,55.33 40.86,55.3 SJ4.2
ADDR1_SX0
  Top 0.2: U1.10 36.95,61.86 37.53,62.44 37.53,62.81 37.48,62.86 37.48,63.96 37.15,64.29 SJ5.2
CAN_H  (via drill 0.35)
  Top 0.2: 62.04,72.76 63.28,72.76 CAN_INPUT1.1 | CAN_INPUT.1 63.19,82.36 62.04,82.36 60.63,80.95 60.63,74.26 62.04,72.85 CAN_INPUT1.1 | 55.79,64.92 55.79,64.83 56.58,64.04 56.58,62.89 57.46,62.01 58.78,62.01 67.95,52.85 67.95,51.97 68.83,51.09 U$1.CANH | 55.79,64.92 55.79,65.98 R7.2 | v55.88,64.92 55.79,64.92 | v58.52,67.25 59.09,67.25 D3.1 | v58.52,69.32 61.96,72.76 CAN_INPUT1.1
  Bottom 0.2: v58.52,69.32 v58.52,67.25 58.2,67.25 v55.88,64.92
CAN_L  (via drill 0.35)
  Top 0.2: J1.2 69.27,89.59 69.27,88.53 65.83,85.09 65.83,81.75 64.51,80.42 63.28,80.42 CAN_INPUT.2 64.51,80.34 64.51,74.79 65.92,73.38 65.92,72.23 63.94,70.25 | v64.42,54.17 68.65,49.94 68.83,49.94 U$1.CANL | 63.94,70.25 63.36,70.82 CAN_INPUT1.2 63.28,70.82 | 63.94,70.25 v64.42,69.76 64.42,69.68 61.6,66.86 61.6,65.98 D3.2
  Bottom 0.2: v64.42,69.76 v64.42,54.17
CAN_RX2
  Top 0.2: U$3.0 43.89,8.18 43.89,8.45 49.8,14.35 49.8,28.8 56.67,35.67 58.17,35.67 CONN01.7
CAN_RX3  (via drill 0.35)
  Top 0.2: v63.63,47.74 63.63,48.53 U$1.R | v39.84,13.64 39.84,16.46 36.23,20.08 36.23,28.71 37.38,29.85 37.38,34.08 38.08,34.79 U$3.30
  Bottom 0.2: v63.63,47.74 63.63,49.77 65.21,51.35 65.74,51.35 70.24,46.86 70.24,20.43 58.96,9.15 44.34,9.15 v39.84,13.64
CAN_TX2
  Top 0.2: U$3.1 43.89,10.74 43.89,11 49.44,16.55 49.44,29.59 56.4,36.55 63.54,36.55 64.33,35.76 CONN01.8
CAN_TX3  (via drill 0.35)
  Top 0.2: v65.48,50.65 63.81,52.32 63.63,52.32 U$1.D | v40.81,13.64 40.81,17.96 38.61,20.16 38.61,28.53 38.17,28.97 38.17,30.3 U$3.31
  Bottom 0.2: v65.48,50.65 65.48,50.47 69.88,46.07 69.88,20.6 58.78,9.5 44.95,9.5 v40.81,13.64
GND_M  (via drill 0.35)
  Top 0.2: v46.8,20.78 46.01,21.57 42.31,21.57 v41.87,21.13 | v43.37,97.78 44.83,99.25 44.83,100.98 v44.07,101.74 44.16,101.74 44.78,102.36 49,102.36 56.67,110.03 v56.67,116.19 | v26.27,66.06 26.45,66.06 30.59,70.2 37.9,70.2 42.04,74.35 POWER_M.2 | v23.46,47.47 23.46,48.53 24.51,49.59 v24.51,64.04 | v24.42,27.56 24.42,28.09 23.54,28.97 23.54,42.63 24.51,43.6 24.51,45.18 v25.31,45.98
  Bottom 0.2: 46.85,20.74 53.5,27.39 53.5,30.56 MOTOR_01.GND_1 | 46.85,20.74 46.01,19.9 46.01,19.37 47.68,17.7 47.68,14.53 MC1.- | 22.57,9.86 24.6,9.86 29.18,14.44 MC3.- | 22.57,9.86 13.41,9.86 8.74,14.53 7.42,14.53 MC2.- | 27.99,23.12 25.39,20.52 25.31,20.52 25.09,20.3 | 27.99,23.12 29.71,24.83 29.71,25.89 MOTOR_03.GND_1 | 25.09,20.3 22.57,17.79 22.57,9.86 | 25.09,20.3 22.79,22.59 | 22.79,22.59 22.31,23.07 8.92,23.07 6.45,25.54 6.45,30.56 MOTOR_02.GND_1 | v41.87,21.13 41.87,20.78 40.46,19.37 31.74,19.37 27.99,23.12 | v46.8,20.78 46.85,20.74 | MC7.- 43.19,136.9 43.19,128.17 42.4,127.38 42.4,126.5 MOTOR_07.GND_1 | MOTOR_06.GND_1 18.43,122.98 18.43,123.15 24.87,129.58 24.87,136.81 MC6.- 24.95,136.9 26.72,138.66 37.11,138.66 38.87,136.9 43.1,136.9 MC7.- | MC7.- 43.28,136.98 48.48,142.18 58.61,142.18 63.81,136.98 64.07,136.98 MC5.- 64.25,136.9 64.25,123.06 64.33,122.98 MOTOR_05.GND_1 64.33,122.89 64.33,122.71 57.81,116.19 v56.67,116.19 | v44.07,101.74 45.04,102.71 46.01,102.71 MC8.- | v43.37,97.78 42.4,96.81 MOTOR_08.GND_1 42.31,96.72 42.31,85.53 41.52,84.74 41.52,74.96 42.04,74.43 POWER_M.2 | v26.27,66.06 23.54,66.06 MC4.- 24.51,65.98 v24.51,64.04 | v23.46,47.47 25.31,47.47 | 25.31,47.47 26.27,47.47 29.8,51 29.8,51.88 MOTOR_04.GND_1 | 22.79,22.59 24.42,24.22 v24.42,27.56 | 25.31,47.47 v25.31,45.98
GND_MCU  (via drill 0.35)
  Top 0.2: SJ4.3 43.45,54.74 43.98,54.21 45.91,54.21 46.67,53.45 v46.67,52.53 46.71,52.5 46.71,51.26 50.94,47.03 59.93,47.03 60.28,47.39 60.28,48.09 58.61,49.77 58.61,49.85 | SJ5.3 36.3,67.81 36.77,68.28 51.02,68.28 | 51.02,68.28 51.52,68.78 53.01,68.78 53.02,68.79 53.11,68.79 C5.2 | 41.34,8.09 27.42,8.09 U$3.GND2 | 41.34,8.09 43.81,5.63 U$3.GND | 41.34,8.09 41.34,8.18 41.52,8.36 v41.52,18.23 41.52,20.52 41.16,20.87 41.16,26.95 v39.14,28.97 | v41.52,43.16 38.87,43.16 35.61,39.9 35.61,39.28 U$3.GND1 | v4.35,122.98 v23.63,122.98 27.07,122.98 | 27.07,122.98 v45.74,122.98 | D2.C 21.61,81.92 21.61,77.87 22.05,77.43 C15.- 22.13,77.34 22.84,77.34 24.34,75.84 28.04,75.84 28.39,76.2 32.09,76.2 33.85,74.43 POWER_MCU.2 33.85,74.35 26.27,66.77 26.01,66.77 24.64,65.4 | 66.1,40.51 63.01,40.51 62.4,41.13 62.4,50.03 62.84,50.47 62.92,50.47 63.54,51.09 U$1.GND | 66.1,40.51 66.27,40.34 66.27,35.14 64.86,33.73 64.42,33.73 CONN01.10 64.33,33.64 CONN01.12 64.42,31.62 65.13,31.62 66.1,30.65 v67.33,30.65 | 24.64,65.4 28.83,61.22 28.83,59.9 C3.2 29.52,59.27 U1.17 36.15,59.27 U1.29 36.95,58.47 U1.3 43.72,58.47 44.57,59.31 C2.2 48.56,59.31 C1.2 48.74,59.46 49.8,59.46 | 24.64,65.4 23.28,66.77 15,66.77 C8.2 | C6.2 53.94,63.51 55.7,63.51 R9.2 | C6.2 53.94,63.6 53.94,65.71 C4.2 53.85,65.8 53.59,65.8 52.18,67.21 51.56,67.21 51.12,67.65 51.12,68.27 51.02,68.28 | 53.94,68.09 C5.2 | STATUS_LED.2 66.01,62.98 62.22,62.98 61.87,62.63 60.63,62.63 60.37,62.89 60.37,64.57 60.63,64.83 60.63,68.09 D3.3 60.55,68.09 54.03,68.09 C5.2 | 49.8,59.46 49.89,59.46 53.85,63.42 C6.2 | 66.1,40.51 66.1,40.96 66.54,41.4 66.54,51.35 64.51,53.38 62.13,53.38 58.61,49.85
  Top 0.2: 58.61,49.85 53.41,49.85 49.8,53.47 49.8,59.46 | v27.07,99.19 27.07,122.98
  Bottom 0.2: v46.67,52.53 45.73,52.53 MOTOR_04.GND_0 45.04,51.88 45.04,47.03 41.52,43.51 v41.52,43.16 41.52,31.35 39.4,29.24 39.14,29.24 | v41.52,18.23 44.95,21.66 44.95,25.89 MOTOR_03.GND_0 | 39.14,29.24 28.39,29.24 27.07,30.56 21.69,30.56 MOTOR_02.GND_0 | 39.14,29.24 v39.14,28.97 | v4.35,122.98 3.19,122.98 MOTOR_06.GND_0 | v23.63,122.98 27.07,126.41 MOTOR_07.GND_0 | v45.74,122.98 49.09,122.98 MOTOR_05.GND_0 | POWER_MCU.2 33.94,74.43 38.08,78.57 38.08,84.65 27.16,95.58 27.16,96.72 MOTOR_08.GND_0 27.07,96.9 v27.07,99.19 | v67.33,30.65 68.74,30.65 MOTOR_01.GND_0
  pour Top: -10.73,158.45 83,158.45 83,-4.62 -10.73,-4.62
  pour Bottom: -10.98,157.43 85.28,157.43 85.28,-3.35 -10.98,-3.35
MA1_01
  Bottom 0.55: MOTOR_01.A1 63.72,30.56 63.72,24.92 CM_01.1
MA1_02
  Bottom 0.55: MOTOR_02.A1 16.58,30.56 16.58,24.75 16.67,24.66 CM_02.1
MA1_03
  Bottom 0.55: MOTOR_03.A1 39.93,25.89 39.93,20.6 CM_03.1
MA1_04
  Bottom 0.55: CM_04.1 40.02,45.98 40.02,51.88 MOTOR_04.A1
MA1_05
  Bottom 0.55: MOTOR_05.A1 54.29,122.98 54.29,127.65 CM_05.1
MA1_06
  Bottom 0.55: MOTOR_06.A1 8.21,122.98 8.21,127.56 8.3,127.65 CM_06.1
MA1_07
  Bottom 0.55: MOTOR_07.A1 32.18,126.5 32.18,131.17 CM_07.1
MA1_08
  Bottom 0.55: MOTOR_08.A1 32.18,96.81 32.18,104.12 CM_08.1
MA2_01
  Bottom 0.55: MOTOR_01.A2 61.16,30.56 61.16,24.92 CM_01.2
MA2_02
  Bottom 0.55: MOTOR_02.A2 14.03,30.56 14.03,24.75 14.12,24.66 CM_02.2
MA2_03
  Bottom 0.55: MOTOR_03.A2 37.38,25.89 37.38,20.6 CM_03.2
MA2_04
  Bottom 0.55: CM_04.2 37.38,45.98 37.38,47.3 37.29,47.39 37.29,51.7 37.46,51.88 MOTOR_04.A2
MA2_05
  Bottom 0.55: MOTOR_05.A2 56.85,122.98 56.85,127.65 CM_05.2
MA2_06
  Bottom 0.55: MOTOR_06.A2 10.77,122.98 10.77,127.56 10.86,127.65 CM_06.2
MA2_07
  Bottom 0.55: MOTOR_07.A2 34.64,126.5 34.64,131.17 CM_07.2
MA2_08
  Bottom 0.55: MOTOR_08.A2 34.73,96.81 34.73,104.12 CM_08.2
MB1_01
  Bottom 0.55: MOTOR_01.B1 56.05,30.56 56.05,24.92 CM_01.4
MB1_02
  Bottom 0.55: MOTOR_02.B1 9.01,30.56 9.01,24.66 CM_02.4
MB1_03
  Bottom 0.55: MOTOR_03.B1 32.27,25.89 32.27,20.6 CM_03.4
MB1_04
  Bottom 0.55: CM_04.4 32.35,45.98 32.35,51.88 MOTOR_04.B1
MB1_05
  Bottom 0.55: MOTOR_05.B1 61.87,122.98 61.87,127.65 CM_05.4
MB1_06
  Bottom 0.55: MOTOR_06.B1 15.88,122.98 15.88,127.65 CM_06.4
MB1_07
  Bottom 0.55: MOTOR_07.B1 39.75,126.5 39.75,131.17 CM_07.4
MB1_08
  Bottom 0.55: MOTOR_08.B1 39.84,96.81 39.84,104.12 CM_08.4
MB2_01
  Bottom 0.55: MOTOR_01.B2 58.61,30.56 58.61,24.92 CM_01.3
MB2_02
  Bottom 0.55: MOTOR_02.B2 11.47,30.56 11.47,24.75 11.56,24.66 CM_02.3
MB2_03
  Bottom 0.55: MOTOR_03.B2 34.82,25.89 34.82,20.6 CM_03.3
MB2_04
  Bottom 0.55: CM_04.3 34.91,45.98 34.91,51.88 MOTOR_04.B2
MB2_05
  Bottom 0.55: MOTOR_05.B2 59.31,122.98 59.31,127.65 CM_05.3
MB2_06
  Bottom 0.55: MOTOR_06.B2 13.32,122.98 13.32,127.65 CM_06.3
MB2_07
  Bottom 0.55: MOTOR_07.B2 37.2,126.5 37.2,131.17 CM_07.3
MB2_08
  Bottom 0.55: MOTOR_08.B2 37.29,96.81 37.29,104.12 CM_08.3
MDIR_01  (via drill 0.35)
  Top 0.2: v50.33,33.38 48.39,31.44 48.39,28.18 43.89,23.69 43.89,23.42 U$3.6
  Bottom 0.2: v50.33,33.38 55.61,33.38 55.7,33.29 59.93,33.29 65.39,38.75 65.39,46.42 65.57,46.59 66.89,46.59 68.74,44.74 68.74,44.57 MOTOR_01.DIR
MDIR_02  (via drill 0.35)
  Top 0.2: v43.89,30.03 43.89,28.53 U$3.8 | v44.95,45.98 41.52,45.98 39.14,48.36 31.21,48.36 v29.53,46.68
  Bottom 0.2: v43.89,30.03 43.89,31.62 44.51,32.23 44.51,37.7 44.16,38.05 44.16,45.18 v44.95,45.98 | v29.53,46.68 27.42,44.57 21.69,44.57 MOTOR_02.DIR
MDIR_03  (via drill 0.35)
  Top 0.2: v45.83,34.17 45.22,33.56 43.89,33.56 U$3.10
  Bottom 0.2: v45.83,34.17 45.83,39.11 45.04,39.9 MOTOR_03.DIR
MDIR_04  (via drill 0.35)
  Top 0.2: v47.86,39.99 46.54,38.66 43.89,38.66 U$3.12 | v48.39,53.91 48.39,58.14 v48.56,58.31
  Bottom 0.2: v47.86,39.99 47.86,40.96 47.51,41.31 47.51,45.98 48.39,46.86 v48.39,53.91 | v48.56,58.31 48.56,62.36 45.13,65.8 MOTOR_04.DIR
MDIR_05  (via drill 0.35)
  Top 0.2: v27.6,32.5 27.42,32.67 27.42,33.47 U$3.15/A1 | v38.43,41.22 39.84,41.22 40.19,41.57 v48.21,41.57 | v49.09,57.52 v49.09,53.2 | v59.93,74.61 59.93,83.07 63.63,86.77 63.63,110.2 56.93,116.9 54.64,116.9 v49.09,111.35
  Bottom 0.2: v27.6,32.5 32.79,32.5 33.15,32.15 33.85,32.15 38.43,36.73 v38.43,41.22 | v48.21,41.57 48.21,46.15 49.09,47.03 v49.09,53.2 | v49.09,57.52 49.09,57.87 55.17,63.95 55.17,69.85 v59.93,74.61 | v49.09,111.35 49.09,108.97 MOTOR_05.DIR
MDIR_06  (via drill 0.35)
  Top 0.2: v23.72,20.69 26.1,18.31 27.33,18.31 U$3.21/A7
  Bottom 0.2: v23.72,20.69 20.02,20.69 17.99,22.72 7.16,22.72 1.87,28 1.87,55.49 6.45,60.07 6.45,110.91 6.28,111.08 5.13,111.08 3.19,109.14 3.19,108.97 MOTOR_06.DIR
MDIR_07  (via drill 0.35)
  Top 0.2: v25.92,12.23 26.89,13.2 27.33,13.2 U$3.23/A9 | v24.78,13.2 24.78,17.43 17.91,24.3 17.91,33.2 1.25,49.85 1.25,90.03 21.52,110.29 24.95,110.29 v26.01,111.35
  Bottom 0.2: v25.92,12.23 25.75,12.23 v24.78,13.2 | v26.01,111.35 27.07,112.4 MOTOR_07.DIR
MDIR_08  (via drill 0.35)
  Top 0.2: v33.41,32.85 33.15,32.59 33.15,30.38 U$3.27 | v16.5,40.6 16.5,42.89 23.46,49.85 23.46,50.56 23.01,51 19.58,51 18.43,49.85 13.41,49.85 9.1,54.17 9.1,59.1 v7.6,60.6
  Bottom 0.2: v33.41,32.85 33.41,33.11 31.03,35.49 21.61,35.49 v16.5,40.6 | v7.6,60.6 7.6,62.45 27.07,81.92 27.07,82.8 MOTOR_08.DIR
MMS1  (via drill 0.35)
  Top 0.2: v33.94,36.55 34.47,36.55 35.53,35.49 35.53,34.88 U$3.28 | v7.95,47.44 13.88,47.44 14.59,46.74 17.31,46.74 v17.82,47.25 | v27.16,45.27 27.33,45.27 29.8,42.81 v29.8,42.28 29.89,42.28 30.5,41.66 34.29,41.66 36.49,43.86 40.11,43.86 40.81,44.57 v52.09,44.57 | v28.74,110.29 39.04,110.29 v41.15,112.4 41.41,112.66 41.5,112.66 41.77,112.93 v49.62,112.93 | 35.88,76.55 35.88,83.6 32.35,87.12 v32.35,93.9 | 35.88,76.55 v35.88,71.26 | 35.88,76.55 v24.6,76.55
  Bottom 0.2: v33.94,36.55 32.97,36.55 29.8,39.72 29.8,39.9 MOTOR_03.MS1 29.8,39.99 v29.8,42.28 | v17.82,47.25 18.47,46.59 23.72,46.59 25.04,45.27 v27.16,45.27 | MOTOR_02.MS1 6.45,44.57 6.45,45.95 v7.95,47.44 7.95,59.46 24.6,76.11 v24.6,76.55 | v52.09,44.57 53.5,44.57 MOTOR_01.MS1 | v41.15,112.4 42.31,112.4 MOTOR_07.MS1 | MOTOR_06.MS1 18.43,108.97 18.43,109.14 20.37,111.08 21.87,111.08 22.66,110.29 v28.74,110.29 28.74,104.56 30.42,102.89 30.42,95.84 v32.35,93.9 | v35.88,71.26 34.91,70.29 32.18,70.29 30.77,68.88 30.77,68.44 29.89,67.56 29.89,65.89 MOTOR_04.MS1 | v49.62,112.93 60.55,112.93 64.33,109.14 64.33,108.97 MOTOR_05.MS1
MMS2  (via drill 0.35)
  Top 0.2: v22.93,111 v16.85,111 | v50.85,111.44 50.15,111.44 49.36,110.64 41.44,110.64 v41.15,110.93 | v34.56,35.49 34.56,33.64 35.53,32.67 35.53,30.38 U$3.29 | v13.24,41.31 14.65,39.9 v22.31,39.9 22.31,47.92 23.81,49.41 v23.81,59.46 | v27.51,63.51 v31.83,63.51 | v54.55,44.57 53.06,44.57 52.35,45.27 40.99,45.27 39.93,44.22 35.88,44.22 v34.03,42.37
  Bottom 0.2: v16.85,111 15.88,110.03 15.88,108.97 MOTOR_06.MS2 15.79,110.03 14.91,110.03 13.85,111.08 7.6,111.08 6.8,110.29 6.8,57.69 3.81,54.7 3.81,47.3 5.57,45.54 5.57,42.72 5.84,42.45 7.6,42.45 8.92,43.77 MOTOR_02.MS2 9.01,44.48 9.01,43.77 11.47,41.31 v13.24,41.31 | v22.93,111 26.45,114.52 35.35,114.52 36.49,113.37 36.49,110.55 36.67,110.38 37.82,110.38 39.84,112.4 MOTOR_07.MS2 39.8,112.28 v41.15,110.93 | v50.85,111.44 60.11,111.44 61.78,109.76 61.78,108.97 MOTOR_05.MS2 | v22.31,39.9 23.24,39.9 27.3,35.85 34.47,35.85 v34.56,35.49 34.56,36.2 34.64,36.29 34.64,37.43 32.35,39.72 32.35,39.9 MOTOR_03.MS2 32.35,39.99 34.03,41.66 v34.03,42.37 | v31.83,63.51 32.35,64.04 32.35,65.8 MOTOR_04.MS2 | v27.51,63.51 27.51,63.16 v23.81,59.46 | v54.55,44.57 55.96,44.57 MOTOR_01.MS2
MSTEP_01  (via drill 0.35)
  Top 0.2: v45.83,20.78 43.89,20.78 U$3.5
  Bottom 0.2: v45.83,20.78 45.83,20.25 45.66,20.08 45.66,13.91 49.71,9.86 58.61,9.86 69.53,20.78 69.53,41.04 66.27,44.3 66.27,44.48 MOTOR_01.STEP
MSTEP_02  (via drill 0.35)
  Top 0.2: v39.14,29.94 39.84,29.24 39.84,28.97 42.84,25.98 43.81,25.98 U$3.7 | v24.87,33.29 24.87,40.96 v24.6,41.22
  Bottom 0.2: v39.14,29.94 28.21,29.94 v24.87,33.29 | v24.6,41.22 22.31,41.22 19.05,44.48 MOTOR_02.STEP
MSTEP_03  (via drill 0.35)
  Top 0.2: v43.81,32.5 43.81,31.09 U$3.9
  Bottom 0.2: v43.81,32.5 43.81,38.58 42.49,39.9 MOTOR_03.STEP
MSTEP_04  (via drill 0.35)
  Top 0.2: v46.54,36.55 46.1,36.11 43.89,36.11 U$3.11
  Bottom 0.2: v46.54,36.55 46.54,40.34 46.8,40.6 46.8,50.47 47.68,51.35 47.68,53.03 44.86,55.84 44.86,62.28 42.57,64.57 42.57,65.8 MOTOR_04.STEP
MSTEP_05  (via drill 0.35)
  Top 0.2: v28.3,43.33 29.09,42.54 29.09,38.14 27.42,36.46 27.42,36.11 U$3.14/A0 | v34.38,56.11 v31.3,53.03 | v48.04,67.21 v42.13,61.31 | v56.85,104.65 v62.13,99.37
  Bottom 0.2: v28.3,43.33 28.3,44.48 31.3,47.47 v31.3,53.03 | v34.38,56.11 34.82,56.11 38.43,59.72 40.55,59.72 v42.13,61.31 | v48.04,67.21 51.56,67.21 62.48,78.13 62.48,99.01 v62.13,99.37 | v56.85,104.65 55.88,104.65 51.65,108.88 MOTOR_05.STEP
MSTEP_06  (via drill 0.35)
  Top 0.2: v23.72,24.48 27.33,20.87 U$3.20/A6 | v20.9,27.3 20.9,31.71 3.46,49.15 3.46,57.34 v3.1,57.69
  Bottom 0.2: v20.9,27.3 v23.72,24.48 | v3.1,57.69 3.1,106.24 5.75,108.88 MOTOR_06.STEP
MSTEP_07  (via drill 0.35)
  Top 0.2: v26.19,60.25 24.87,58.93 24.87,47.92 23.01,46.07 23.01,20.43 27.33,16.11 27.33,15.85 U$3.22/A8 | v29.45,77.34 31.65,79.54 31.65,102.63 v30.86,103.42
  Bottom 0.2: v26.19,60.25 26.19,60.69 28.57,63.07 28.57,72.41 28.12,72.85 28.12,76.02 v29.45,77.34 | v30.86,103.42 30.86,111.26 29.71,112.4 MOTOR_07.STEP
MSTEP_08  (via drill 0.35)
  Top 0.2: v31.56,34 32.35,34.79 33.06,34.79 U$3.26 | v19.58,34 6.99,46.58 v6.99,48.39 | v27.6,80.51 28.57,80.51 v30.68,82.63
  Bottom 0.2: v19.58,34 v31.56,34 | v27.6,80.51 23.9,76.81 23.9,75.93 7.25,59.28 7.25,48.64 v6.99,48.39 | v30.68,82.63 29.89,82.63 29.71,82.8 MOTOR_08.STEP
N$1
  Top 0.2: SJ1.3 38.29,50.96 R2.2
N$2
  Top 0.2: C9.1 6.45,66.68 6.45,63.77 6.89,63.33 7.6,63.33 U$2.VCAPH
N$4
  Top 0.2: 5.48,62.63 4.6,62.63 3.99,63.24 3.28,63.24 U$2.GPD | 5.48,62.63 7.6,62.63 U$2.GDRIVE | 5.48,62.63 5.48,72.41 5.4,72.5 U$4.1
N$5
  Top 0.2: C9.2 4.6,66.68 4.6,65.27 3.28,63.95 U$2.VCAPL
N$6
  Top 0.2: R9.1 57.46,63.42 57.9,63.42 68.92,52.41 68.91,52.4 U$1.RS 69.41,52.4 69.44,52.37 69.44,52.28
N$7
  Top 0.2: SJ1.1 35.57,50.32 36.51,51.26 R4.2
N$8
  Top 0.2: R5.1 40.04,52.97 SJ4.1
N$9
  Top 0.2: C7.2 12.18,65.18 14.91,65.18 C8.1
N$10
  Top 0.2: R6.1 36.27,63.44 SJ5.1
N$12
  Top 0.2: D1.A 21.52,86.24 D2.A
N$13
  Top 0.2: R8.2 59.49,63.51 59.49,63.95 57.46,65.98 R7.1 57.37,66.06 56.67,66.77 53.67,66.77 52.44,68 52.18,68 C5.1
N$14
  Top 0.2: 61.25,63.51 R8.1 61.25,63.6 61.25,63.95 66.54,69.24 66.54,70.29 70.5,74.26 70.5,91 69.36,92.14 J1.1
N$193
  Top 0.2: R10.1 69.36,59.46 69.36,62.98 STATUS_LED.1
NEO_PIXEL
  Top 0.2: U$3.3 43.89,15.85 49.09,21.04 49.09,29.77 57.02,37.7 58.17,37.7 CONN01.5
PIN_2  (via drill 0.35)
  Top 0.2: v48.74,18.14 43.89,13.29 U$3.2 | v50.5,21.66 50.5,28.53 v55.96,34 | v62.13,37.43 64.07,37.43 64.33,37.7 CONN01.6
  Bottom 0.2: v48.74,18.14 48.74,19.9 v50.5,21.66 | v55.96,34 58.7,34 v62.13,37.43
REG_5V
  Top 0.2: 1.61,74.52 1.61,76.37 7.86,82.63 U$4.4 7.95,82.71 8.74,83.51 17.02,83.51 17.2,83.33 17.2,79.72 22.05,74.87 22.05,72.67 C15.+ | 1.61,74.52 1.61,52.06 2.49,51.18 2.49,50.12 S1.6 | 1.61,74.52 6.01,74.52 7.6,72.94 7.6,63.95 U$2.CATHODE
SCL_00  (via drill 0.35)
  Top 0.2: U1.25 36.55,56.05 37.95,54.65 R2.1 38.34,54.61 38.34,54.35 39.05,53.64 v39.05,49.41 | v38.17,47.65 31.47,47.65 29.8,45.98 26.89,45.98 25.57,44.66 25.57,28 26.89,26.68 28.83,26.68 29.09,26.42 29.09,25.1 27.42,23.42 U$3.19/A5
  Bottom 0.2: v39.05,49.41 39.05,48.53 v38.17,47.65
SCL_01
  Top 0.2: U$3.16/A2 27.42,31.09 27.42,31.35 29.45,33.38 29.45,36.46 30.59,37.61 31.12,37.61 32.35,38.84 32.35,40.78 32.88,41.31 36.49,41.31 38.7,43.51 40.9,43.51 41.25,43.86 56.05,43.86 58.17,41.75 CONN01.1
SCL_02
  Top 0.2: U$3.24 30.59,34.88 30.86,34.88 33.23,37.26 47.68,37.26 50.15,39.72 CONN01.3
SDA_00
  Top 0.2: U1.24 36.15,55.69 36.51,55.33 R4.1 36.49,54.61 36.14,54.61 35.35,53.82 34.12,53.82 24.87,44.57 24.87,42.45 23.9,41.48 23.9,29.15 27.07,25.98 27.33,25.98 U$3.18/A4
SDA_01
  Top 0.2: U$3.17/A3 27.42,28.53 27.42,28.8 29.8,31.18 29.8,36.29 30.77,37.26 32.71,37.26 33.06,37.61 36.23,37.61 37.38,38.75 37.38,41.13 38.52,42.28 55.08,42.28 56.4,40.96 59.93,40.96 62.04,43.07 62.04,52.23 62.84,53.03 64.33,53.03 66.18,51.18 66.18,43.51 64.42,41.75 CONN01.2
SDA_02  (via drill 0.35)
  Top 0.2: v33.68,18.67 33.68,20.87 30.59,23.95 30.59,30.3 U$3.25 | v44.25,22.28 45.04,22.28 48.74,25.98 48.74,30.82 56.85,38.93 63.54,38.93 CONN01.4
  Bottom 0.2: v33.68,18.67 40.63,18.67 v44.25,22.28
STATUS_PIN  (via drill 0.35)
  Top 0.2: v60.37,22.37 62.31,24.3 62.31,25.1 63.28,26.07 63.72,26.07 69.8,32.15 69.8,52.85 67.68,54.96 67.68,59.37 R10.2 | v46.71,19.64 45.22,19.64 43.89,18.31 U$3.4
  Bottom 0.2: v60.37,22.37 49.44,22.37 v46.71,19.64
TRQ1  (via drill 0.35)
  Top 0.2: v37.29,36.55 38.7,36.55 40.37,34.88 40.63,34.88 U$3.32 40.72,34.88 41.08,35.23 46.19,35.23 48.12,37.17 v51.38,37.17 | v48.41,101.15 v33.85,86.59
  Bottom 0.2: MOTOR_02.1 11.39,44.57 11.39,51.97 9.8,53.55 9.8,60.25 30.33,80.78 35.35,80.78 37.2,82.63 37.2,82.8 MOTOR_08.1 37.2,82.89 37.2,83.07 33.72,86.55 | 33.72,86.55 26.27,93.99 26.27,95.58 13.32,108.53 13.32,108.88 MOTOR_06.1 | 49.14,101.88 49.27,101.74 53.76,101.74 55.17,103.15 60.63,103.15 | 49.14,101.88 48.12,102.89 48.12,111.96 45.57,114.52 39.14,114.52 37.29,112.67 37.29,112.49 MOTOR_07.1 | 60.63,103.15 61.07,103.59 61.07,104.74 59.4,106.41 59.4,108.88 MOTOR_05.1 | v37.29,36.55 37.29,37.34 34.91,39.72 34.91,39.9 MOTOR_03.1 | v51.38,37.17 58.52,44.3 58.52,44.48 MOTOR_01.1 58.52,44.57 58.52,44.74 47.86,55.4 47.86,60.34 44.34,63.86 44.34,67.3 44.03,67.61 | 44.03,67.61 43.37,68.27 37.2,68.27 35,66.06 35,65.89 MOTOR_04.1 | 60.63,103.15 60.63,100.07 61.43,99.28 61.43,98.93 62.13,98.22 62.13,78.31 51.74,67.91 44.34,67.91 44.03,67.61 | v33.85,86.59 33.76,86.59 33.72,86.55 | 49.14,101.88 v48.41,101.15
TRQ2  (via drill 0.35)
  Top 0.2: U$3.33 40.63,30.38 v40.63,32.85 40.99,32.85 42.13,34 42.13,34.08 42.93,34.88 v46.8,34.88 | v24.87,96.02 27.77,98.93 27.77,101.39 34.64,108.26 v34.64,108.62 34.73,108.62 35.79,109.67 v55.35,109.67
  Bottom 0.2: v40.63,32.85 40.63,36.55 39.14,38.05 39.14,41.48 38.7,41.92 38.17,41.92 37.38,41.13 37.38,39.99 MOTOR_03.2 | 49.4,37.48 50.41,36.46 53.15,36.46 61.16,44.48 MOTOR_01.2 61.07,44.57 61.07,45.36 58.96,47.47 58.96,50.21 62.84,54.08 62.84,103.51 60.11,106.24 60.11,110.91 59.93,111.08 58.78,111.08 56.76,109.06 MOTOR_05.2 56.76,108.97 56.05,108.97 v55.35,109.67 | 49.4,37.48 47.15,39.72 47.15,46.15 48.04,47.03 48.04,53.2 47.51,53.73 47.51,60.16 43.98,63.69 43.98,67.12 43.19,67.91 39.4,67.91 37.55,66.06 37.55,65.89 MOTOR_04.2 | 49.4,37.48 v46.8,34.88 | 29.01,84.92 28.83,84.74 28.83,79.81 9.45,60.43 9.45,53.38 9.71,53.11 9.71,43.6 10.86,42.45 12.09,42.45 13.94,44.3 13.94,44.48 MOTOR_02.2 | 29.01,84.92 32.79,84.92 34.64,83.07 34.64,82.89 MOTOR_08.2 | 24.82,95.97 25.92,94.87 25.92,88.09 29.01,85.01 29.01,84.92 | 24.82,95.97 18.87,101.92 17.64,101.92 12.53,107.03 12.53,107.12 10.77,108.88 MOTOR_06.2 | v34.64,108.62 34.64,112.4 MOTOR_07.2 | v24.87,96.02 24.82,95.97
VCC_5V  (via drill 0.35)
  Top 0.3: v65.13,30.65 62.75,30.65 61.78,31.62 58.17,31.62 CONN01.11 | v20.2,29.41 20.2,22.63 25.48,17.34 25.48,12.94 25.22,12.68 25.22,7.39 26.98,5.63 27.33,5.63 U$3.VIN | v2.31,59.46 8.13,53.64 8.13,52.67 S1.2 8.21,52.5 9.8,52.5 14.6,47.7 v15.61,47.7
  Bottom 0.3: 7.6,120.77 5.75,122.62 5.75,122.89 MOTOR_06.FAULT | 17.55,120.77 24.16,120.77 29.62,126.24 29.62,126.41 MOTOR_07.FAULT 29.71,126.15 31.56,124.3 42.93,124.3 43.19,124.56 43.19,127.56 44.25,128.61 46.27,128.61 51.65,123.24 51.65,122.98 MOTOR_05.FAULT | 17.55,120.77 7.6,120.77 | 17.55,120.77 17.55,107.03 17.73,106.85 20.37,106.85 29.62,97.6 29.62,96.81 MOTOR_08.FAULT | MOTOR_01.FAULT 66.18,30.65 v65.13,30.65 65.04,30.74 65.04,31.97 64.33,32.67 48.83,32.67 42.49,26.33 MOTOR_03.FAULT 42.4,25.98 42.4,26.24 40.37,28.27 21.16,28.27 20.11,29.33 v20.2,29.41 19.14,30.47 MOTOR_02.FAULT 19.05,30.65 19.05,30.82 15.61,34.26 v15.61,47.7 16.1,48.18 26.36,48.18 28.21,50.03 28.21,53.03 29.18,53.99 40.72,53.99 42.49,52.23 42.49,51.97 MOTOR_04.FAULT | v2.31,59.46 2.31,110.91 7.51,116.1 7.51,120.69 7.6,120.77
VCC_M  (via drill 0.35)
  Top 0.4: v47.86,133.2 v42.49,133.2 | v2.93,15.85 v2.93,28.45 | v25.57,19.81 v25.57,21.66 | v20.99,68.18 26.72,68.18 v30.42,71.88 | v14.21,41.31 22.75,49.85 v22.75,50.29 | v48.83,103.15 43.15,103.15 43.02,103.02 43.02,100.71 v44.04,99.7
  Bottom 0.4: 29.62,133.2 29.62,131.79 20.99,123.15 20.99,122.98 MOTOR_06.VM | 29.62,133.2 29.62,136.81 MC6.+ | MC5.+ 68.92,136.9 68.92,124.91 66.98,122.98 MOTOR_05.VM 66.8,122.8 66.8,122.54 59.66,115.4 56.4,115.4 52.44,119.36 52.44,120.6 52.35,120.77 | 44.95,120.77 44.95,126.41 MOTOR_07.VM | 44.95,120.77 44.95,116.55 50.06,111.44 50.06,107.82 50.85,107.03 50.85,102.8 MC8.+ 50.68,103.15 v48.83,103.15 | 48.04,133.2 48.04,129.41 52.62,124.83 52.62,121.04 52.35,120.77 | 48.04,133.2 48.04,136.9 MC7.+ | 44.95,120.77 52.35,120.77 | v42.49,133.2 29.62,133.2 | v47.86,133.2 48.04,133.2 | 31.12,13.73 26.72,9.33 9.89,9.33 4.69,14.53 2.66,14.53 MC2.+ 2.93,14.7 v2.93,15.85 | 31.12,13.73 31.12,15.32 30.86,15.58 25.57,15.58 | 25.57,15.58 25.48,15.58 24.42,14.53 MC3.+ | 31.12,13.73 31.3,13.64 31.74,13.2 37.11,13.2 38.34,14.44 42.93,14.44 MC1.+ 43.01,14.61 43.01,19.02 50.94,26.95 50.94,30.56 MOTOR_01.VM | v2.93,28.45 3.81,29.33 3.81,30.56 MOTOR_02.VM 3.99,30.74 3.99,31.53 12.97,40.51 13.5,40.51 14.21,41.22 v14.21,41.31 | v25.57,21.66 27.16,23.25 27.16,25.89 MOTOR_03.VM | 25.57,15.58 v25.57,19.81 | 43.53,98.67 44.86,97.34 44.86,96.81 MOTOR_08.VM | v20.99,68.18 18.96,66.15 MC4.+ 18.79,66.06 18.79,62.1 27.24,53.64 27.24,51.97 MOTOR_04.VM 27.07,51.88 26.8,51.88 25.22,50.29 v22.75,50.29 | v30.42,71.88 35.44,71.88 37.9,74.35 POWER_M.1 38.17,74.43 40.72,76.99 40.72,98.04 41.69,99.01 43.19,99.01 43.53,98.67 | v44.04,99.7 43.53,98.67
VCC_MCU
  Top 0.4: 12.09,70.73 12.09,70.91 10.5,72.5 U$4.3 10.59,72.67 10.59,74.52 15.7,79.63 15.7,81.92 D1.C | 12.09,70.73 12.09,66.86 C7.1 12,66.68 11.21,65.89 11.21,64.04 8.57,61.39 6.72,61.39 6.19,61.92 3.28,61.92 U$2.ANODE | 12.09,70.73 22.93,70.73 26.54,74.35 29.89,74.35 POWER_MCU.1

### Text on the board
tPlace: 7 | 6 | 5 | 8 | CAN J | INPUT | HIGH | 5V | GND | CAN BUS | GND | GND | LOW | HIGH | MCU | MOTOR | LOW | OUTPUT | G | OFF | ADDR | ON | 4 | GND | 3.3V | GND | 5V | 2 | 1 | 3 | 3.3V | VIN | GND
bPlace: 7 | 6 | 5 | 8 | MCU | MOTOR | GND | GND | 4 | 2 | 1 | 3